# EAGLE board AM_BE200_x24_Rev2 (EAGLE 6.5.0), part 1 of 3
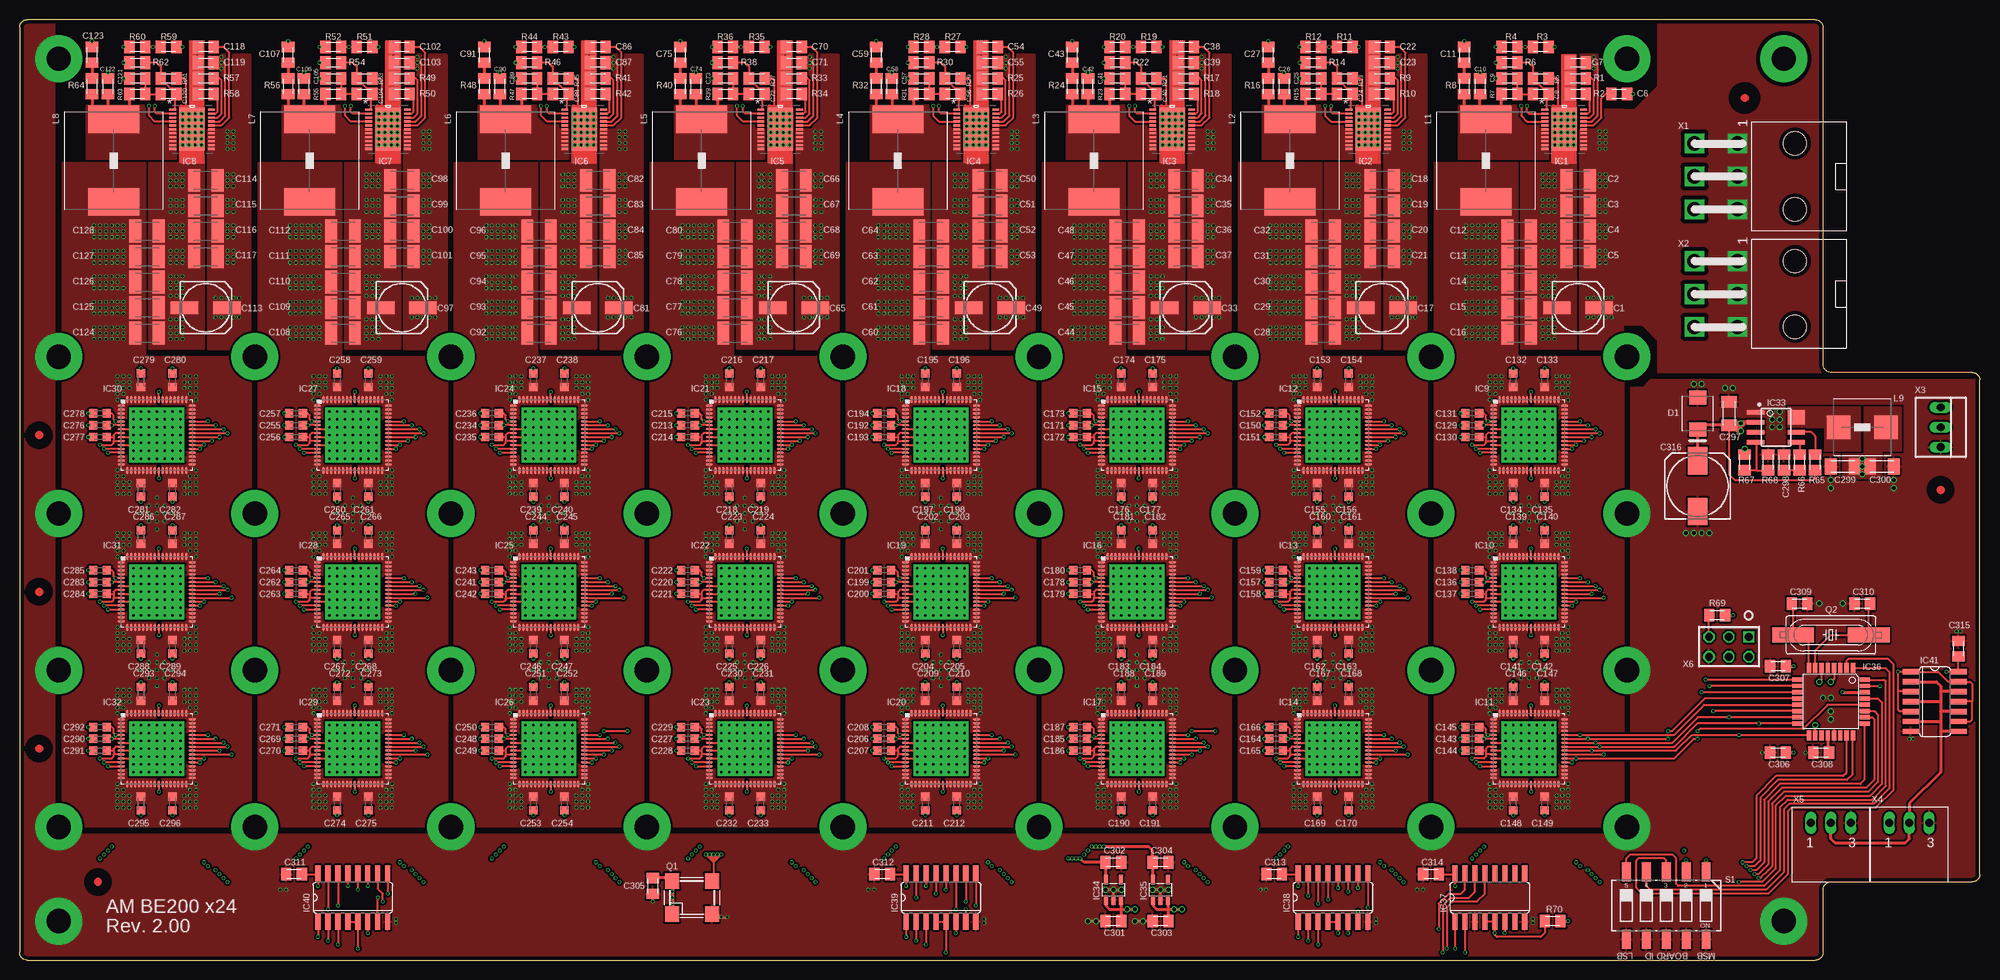
[diagram p9: board, top side]
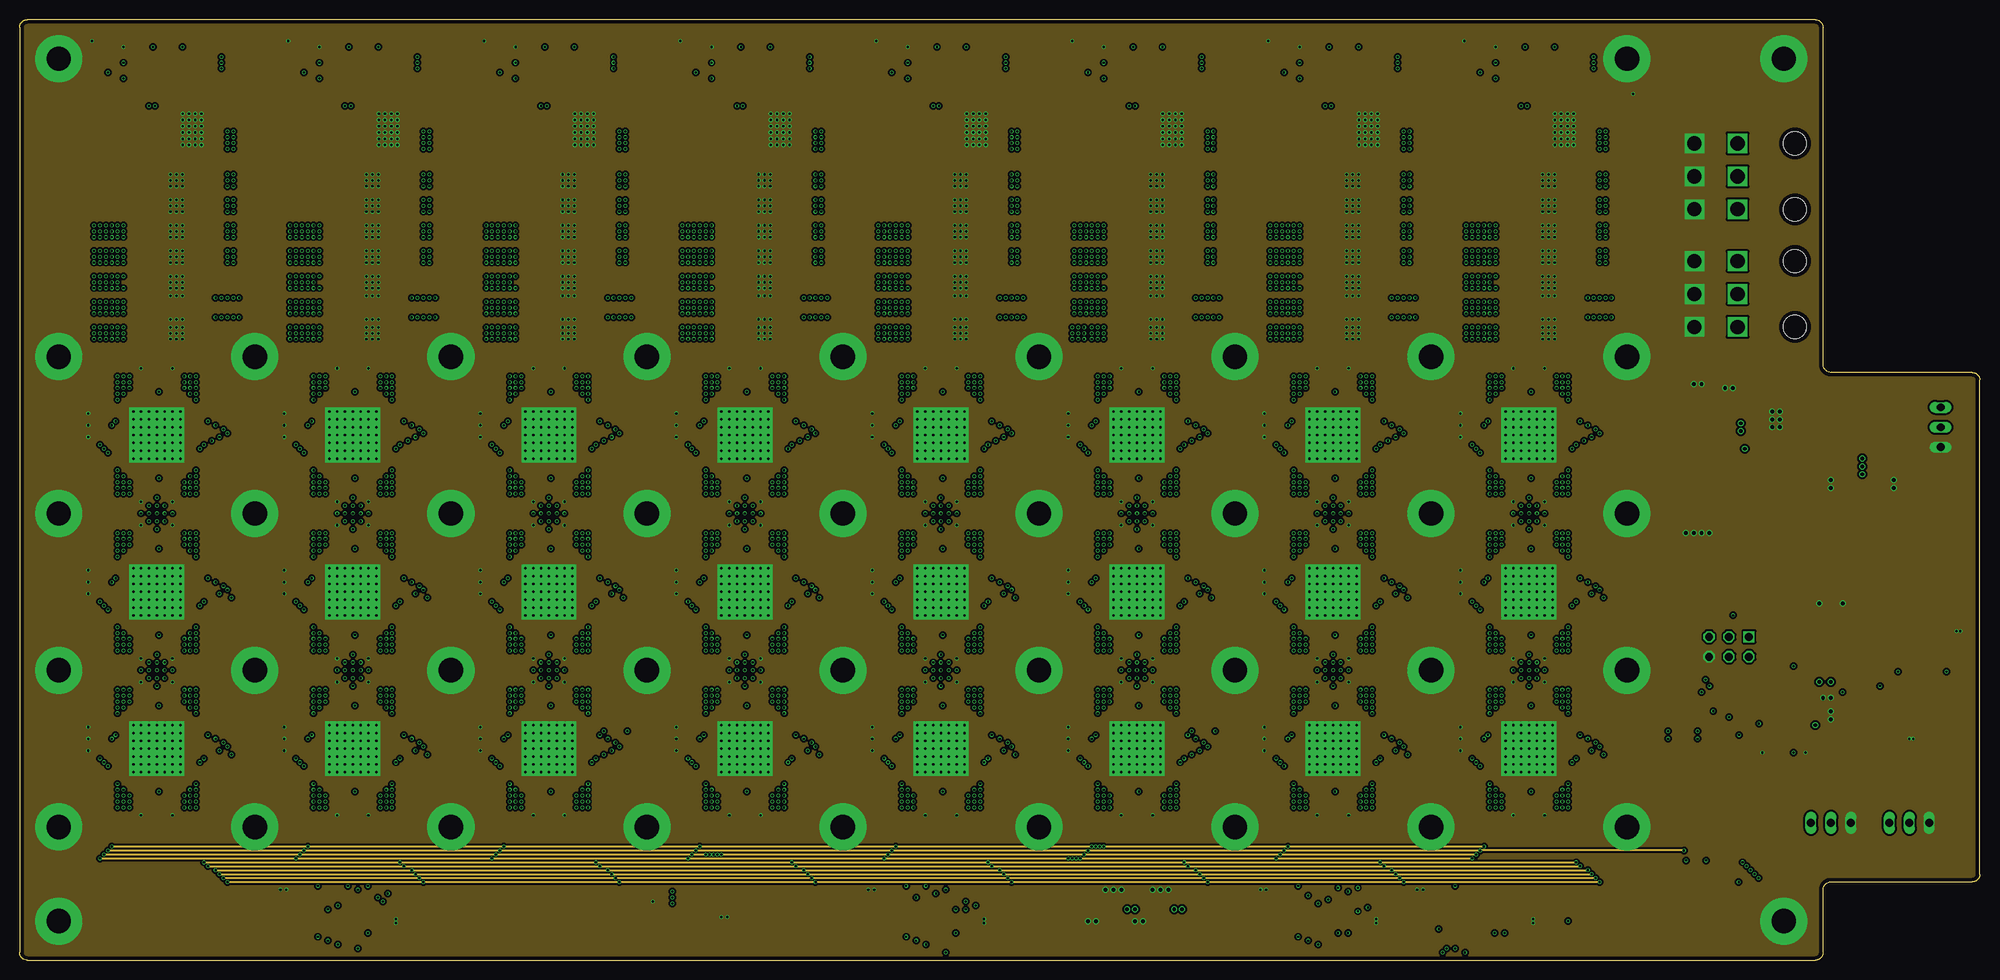
[diagram p10: board, inner layer Route2]
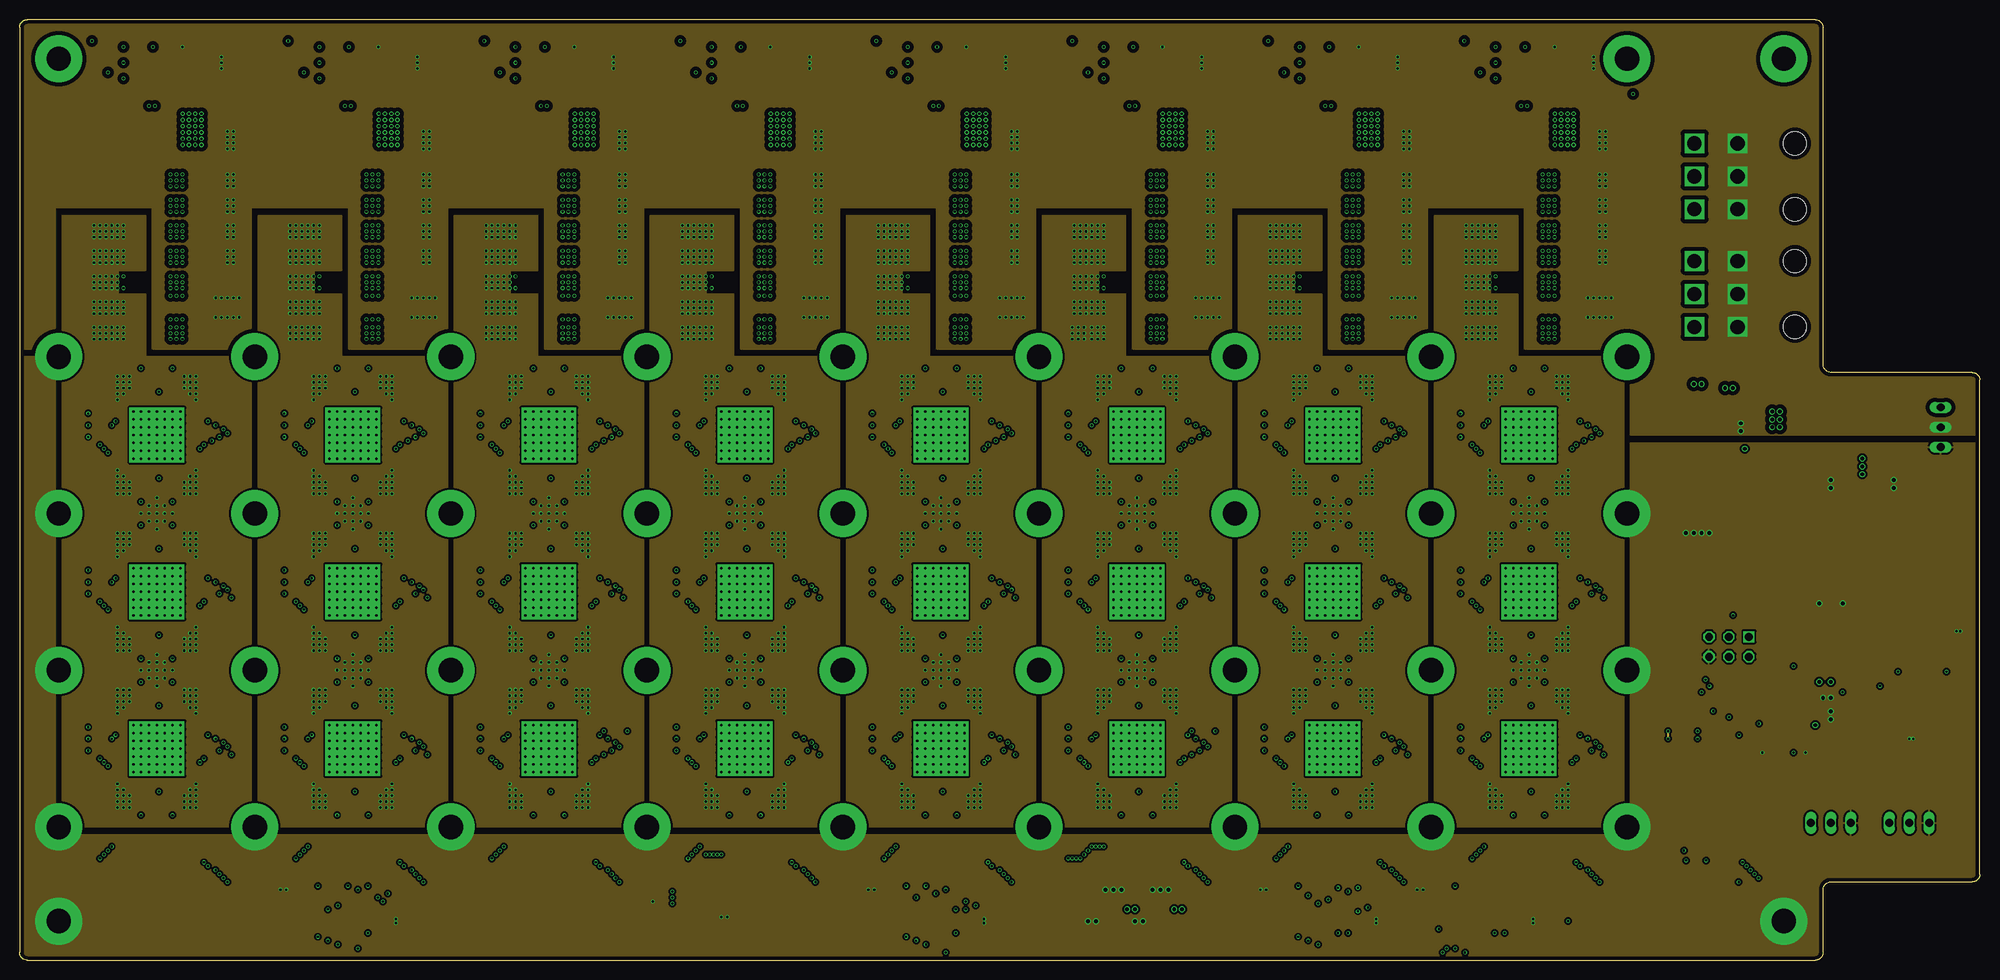
[diagram p11: board, inner layer Route3]
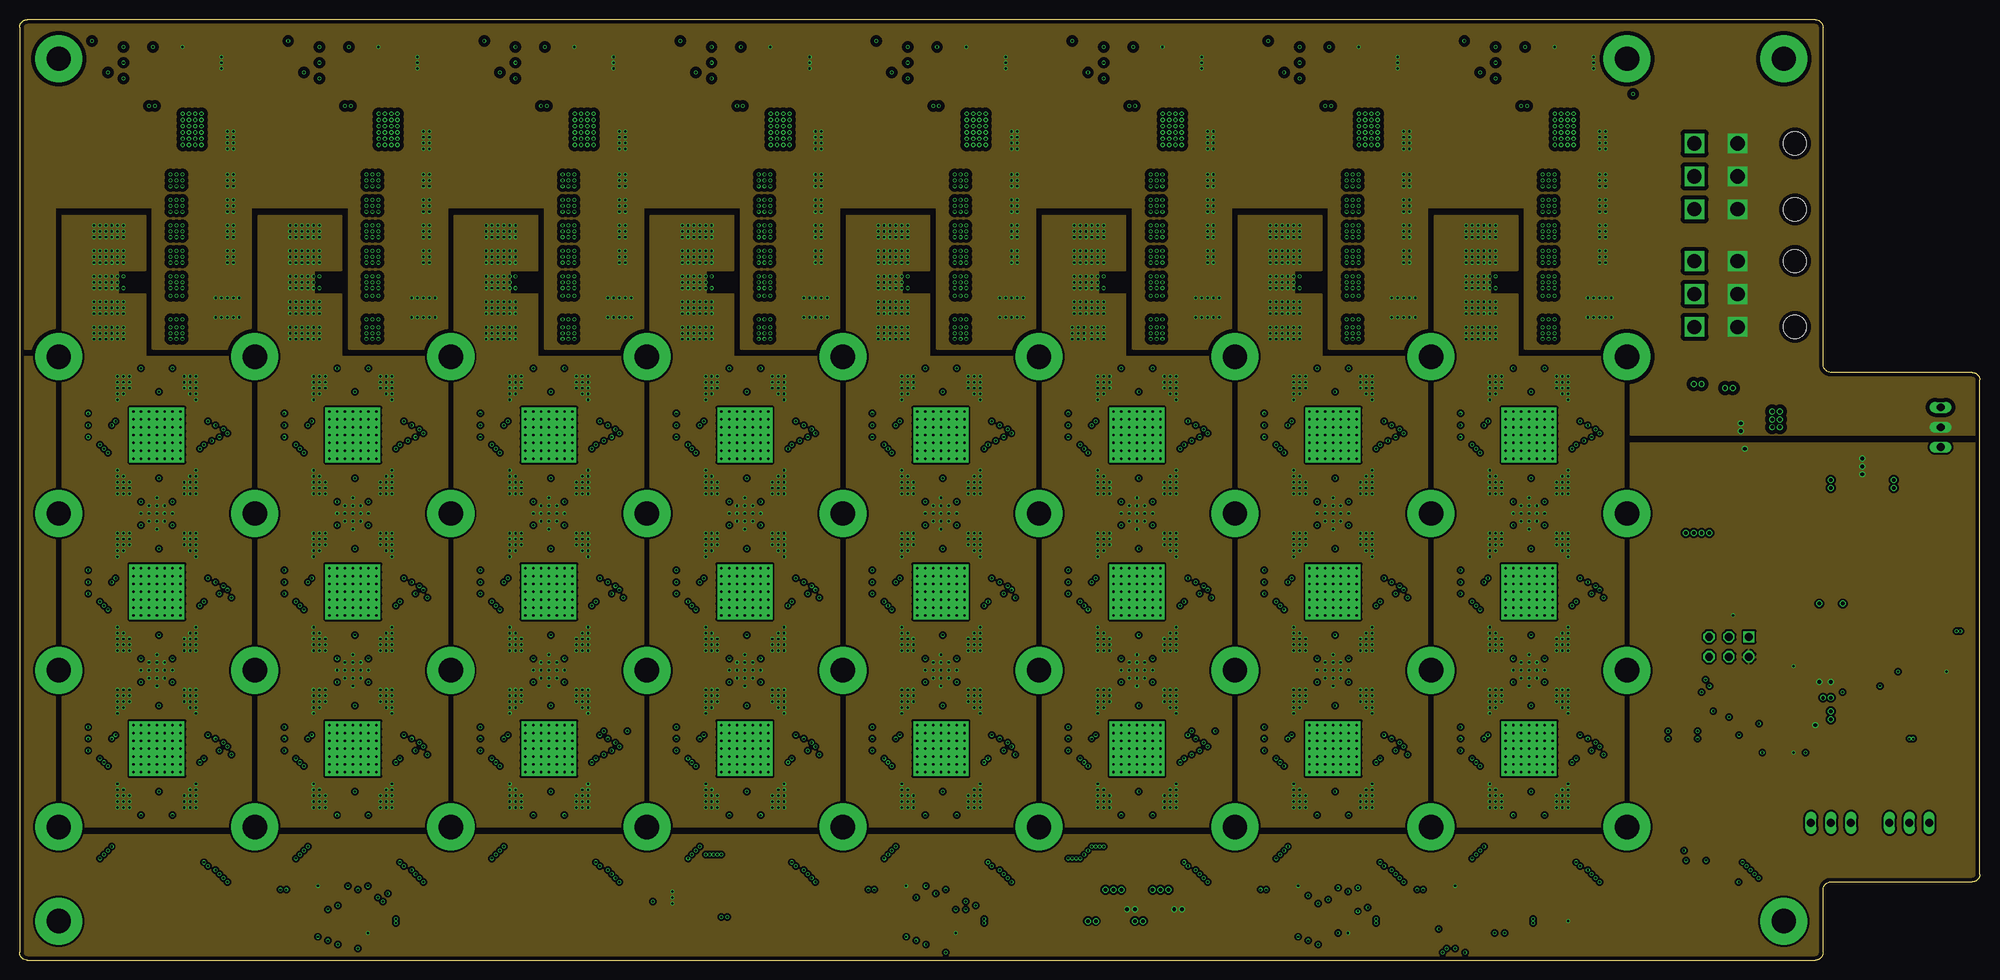
[diagram p12: board, inner layer Route14]
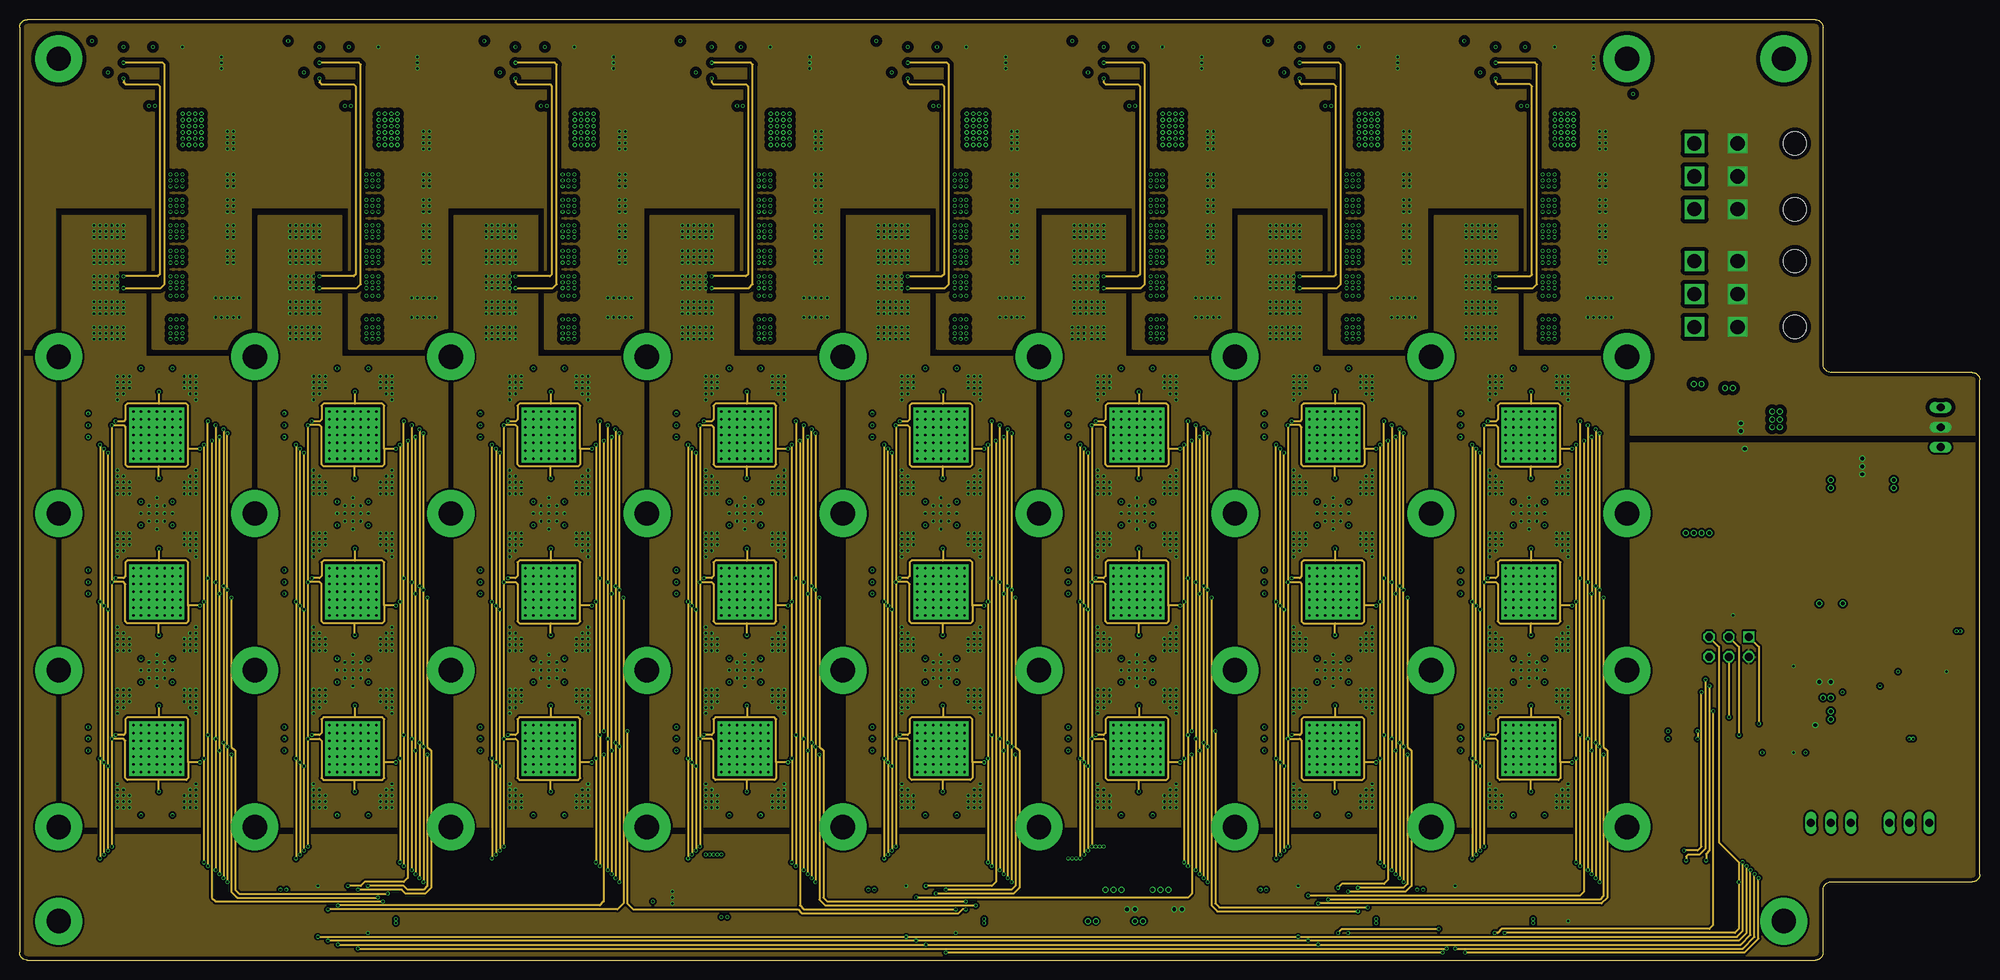
[diagram p13: board, inner layer Route15]
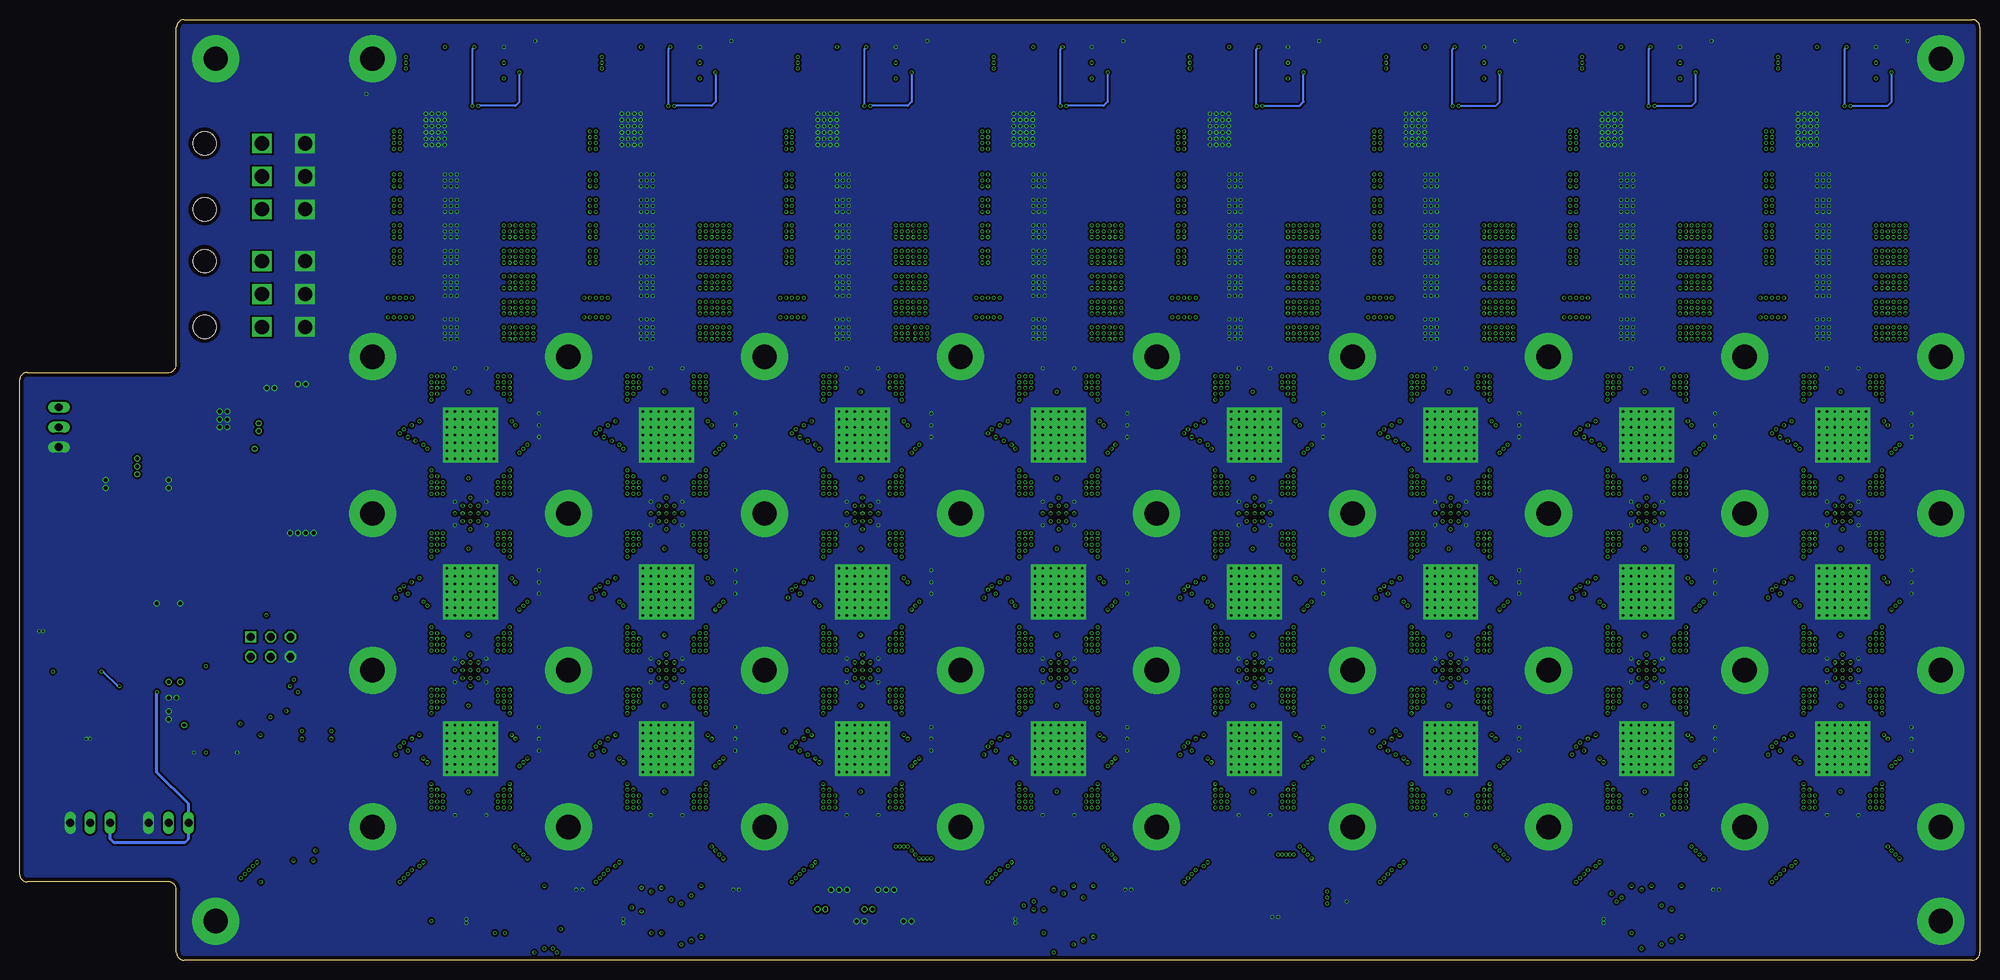
[diagram p14: board, bottom side, seen from below]

Size 250 x 120 mm. Coordinates in mm from the lower left corner, seen from the top.
Outline: 0,119 0,1 arc90 1,0 229,0 arc90 230,1 230,9 arc-90 231,10 249,10 arc90 250,11 250,74 arc90 249,75 231,75 arc-90 230,76 230,119 arc90 229,120 1,120 arc90 0,119
Copper layers (1*2*3*14*15*16): Top 0.035mm / dielectric 0.25mm / Route2 0.035mm / dielectric 0.25mm / Route3 0.035mm / dielectric 0.25mm / Route14 0.035mm / dielectric 0.25mm / Route15 0.035mm / dielectric 0.25mm / Bottom 0.035mm
Design rules "default *": minimum track width 8mil, minimum drill 0.3mm, track to track 5mil, track to pad 5mil, pad to pad 5mil, via to via 5mil, smd to smd 4mil, copper to edge 20mil, drill to drill 8mil, minimum pad ring 5mil, minimum via ring 0mil, stop-mask expansion 4mil, vias tented up to drill 30mil, thermal gap 10mil
tRestrict: area 218.2,61.2 to 221.2,68.2; area 20,109.2 to 23.8,117.5; area 45,109.2 to 48.8,117.5; area 70,109.2 to 73.8,117.5; area 95,109.2 to 98.8,117.5; area 120,109.2 to 123.8,117.5; area 145,109.2 to 148.8,117.5; area 170,109.2 to 173.8,117.5; area 195,109.2 to 198.8,117.5

## Footprints (pad centres in the part's own frame; a part is rotated, then mirrored left to right if it is on the bottom)
153CLV-0605 = smd 3.5 x 1.6: + 2.7,0; - -2.7,0
C1210K = smd 1.5 x 2.9: 1 -1.5,0; 2 1.5,0
C0805K = smd 1.3 x 1.6: 1 -1,0; 2 1,0
MYRCL_C0603K = smd 1.05 x 1.08: 1 -0.875,0; 2 0.875,0
C1206K = smd 1.5 x 2: 1 -1.5,0; 2 1.5,0
MYRCL_153CLV-0810 = smd 3.5 x 2.5: + 3.25,0; - -3.25,0
SMBJ = smd 1.78 x 2.16: A 2.04,0; C -2.03,0
DQP22_5P479X3P24 = smd 0.85 x 0.28: 1 -2.475,2.5; 2 -2.475,2; 3 -2.475,1.5; 4 -2.475,1; 5 -2.475,0.5; 6 -2.475,0; 7 -2.475,-0.5; 8 -2.475,-1; 9 -2.475,-1.5; 10 -2.475,-2; 11 -2.475,-2.5; 12 2.475,-2.5; 13 2.475,-2; 14 2.475,-1.5; 15 2.475,-1; 16 2.475,-0.5; 17 2.475,0; 18 2.475,0.5; 19 2.475,1; 20 2.475,1.5; 21 2.475,2; 22 2.475,2.5 | smd 3.24 x 5.48: 23 0,0 | drill 0.3: GND@1 -1.2,2; GND@2 -0.4,2; GND@3 0.4,2; GND@4 1.2,2; GND@5 -1.2,1.2; GND@6 -0.4,1.2; GND@7 0.4,1.2; GND@8 1.2,1.2; GND@9 -1.2,0.406; GND@10 -0.4,0.4; GND@11 0.4,0.4; GND@12 1.2,0.406; GND@13 -1.2,-0.406; GND@14 -0.4,-0.4; GND@15 0.4,-0.4; GND@16 1.2,-0.406; GND@17 -1.2,-1.2; GND@18 -0.4,-1.2; GND@19 0.4,-1.2; GND@20 1.2,-1.2; GND@21 -1.2,-2; GND@22 -0.4,-2; GND@23 0.4,-2; GND@24 1.2,-2
QFN64-9X9 = smd 0.95 x 0.28: 1 -4.525,3.75; 2 -4.525,3.25; 3 -4.525,2.75; 4 -4.525,2.25; 5 -4.525,1.75; 6 -4.525,1.25; 7 -4.525,0.75; 8 -4.525,0.25; 9 -4.525,-0.25; 10 -4.525,-0.75; 11 -4.525,-1.25; 12 -4.525,-1.75; 13 -4.525,-2.25; 14 -4.525,-2.75; 15 -4.525,-3.25; 16 -4.525,-3.75; 33 4.525,-3.75; 34 4.525,-3.25; 35 4.525,-2.75; 36 4.525,-2.25; 37 4.525,-1.75; 38 4.525,-1.25; 39 4.525,-0.75; 40 4.525,-0.25; 41 4.525,0.25; 42 4.525,0.75; 43 4.525,1.25; 44 4.525,1.75; 45 4.525,2.25; 46 4.525,2.75; 47 4.525,3.25; 48 4.525,3.75 | smd 0.28 x 0.95: 17 -3.75,-4.525; 18 -3.25,-4.525; 19 -2.75,-4.525; 20 -2.25,-4.525; 21 -1.75,-4.525; 22 -1.25,-4.525; 23 -0.75,-4.525; 24 -0.25,-4.525; 25 0.25,-4.525; 26 0.75,-4.525; 27 1.25,-4.525; 28 1.75,-4.525; 29 2.25,-4.525; 30 2.75,-4.525; 31 3.25,-4.525; 32 3.75,-4.525; 49 3.75,4.525; 50 3.25,4.525; 51 2.75,4.525; 52 2.25,4.525; 53 1.75,4.525; 54 1.25,4.525; 55 0.75,4.525; 56 0.25,4.525; 57 -0.25,4.525; 58 -0.75,4.525; 59 -1.25,4.525; 60 -1.75,4.525; 61 -2.25,4.525; 62 -2.75,4.525; 63 -3.25,4.525; 64 -3.75,4.525 | drill 0.3 pad 1 square: EXP@1 -3,3; EXP@2 -2,3; EXP@3 -1,3; EXP@4 0,3; EXP@5 1,3; EXP@6 2,3; EXP@7 3,3; EXP@8 -3,2; EXP@9 -2,2; EXP@10 -1,2; EXP@11 0,2; EXP@12 1,2; EXP@13 2,2; EXP@14 3,2; EXP@15 -3,1; EXP@16 -2,1; EXP@17 -1,1; EXP@18 0,1; EXP@19 1,1; EXP@20 2,1; EXP@21 3,1; EXP@22 -3,0; EXP@23 -2,0; EXP@24 -1,0; EXP@25 0,0; EXP@26 1,0; EXP@27 2,0; EXP@28 3,0; EXP@29 -3,-1; EXP@30 -2,-1; EXP@31 -1,-1; EXP@32 0,-1; EXP@33 1,-1; EXP@34 2,-1; EXP@35 3,-1; EXP@36 -3,-2; EXP@37 -2,-2; EXP@38 -1,-2; EXP@39 0,-2; EXP@40 1,-2; EXP@41 2,-2; EXP@42 3,-2; EXP@43 -3,-3; EXP@44 -2,-3; EXP@45 -1,-3; EXP@46 0,-3; EXP@47 1,-3; EXP@48 2,-3; EXP@49 3,-3
AOZ1021 = smd 0.6 x 2.2: AGND 0.635,-2.6; COMP 1.905,2.6; EN 0.635,2.6; FB 1.905,-2.6; PGND -1.905,-2.6; VIN -0.635,-2.6 | smd 1.87 x 2.2: LX -1.27,2.6
SOT-23-5 = smd 0.55 x 1.2: 1 -0.95,-1.3; 2 0,-1.3; 3 0.95,-1.3; 4 0.95,1.3; 5 -0.95,1.3
TQFP32-08 = smd 1.27 x 0.559: 1 -4.293,2.8; 2 -4.293,2; 3 -4.293,1.2; 4 -4.293,0.4; 5 -4.293,-0.4; 6 -4.293,-1.2; 7 -4.293,-2; 8 -4.293,-2.8; 17 4.293,-2.8; 18 4.293,-2; 19 4.293,-1.2; 20 4.293,-0.4; 21 4.293,0.4; 22 4.293,1.2; 23 4.293,2; 24 4.293,2.8 | smd 0.559 x 1.27: 9 -2.8,-4.293; 10 -2,-4.293; 11 -1.2,-4.293; 12 -0.4,-4.293; 13 0.4,-4.293; 14 1.2,-4.293; 15 2,-4.293; 16 2.8,-4.293; 25 2.8,4.293; 26 2,4.293; 27 1.2,4.293; 28 0.4,4.293; 29 -0.4,4.293; 30 -1.2,4.293; 31 -2,4.293; 32 -2.8,4.293
SO16 = smd 0.66 x 2.032: 1 -4.445,-3.073; 2 -3.175,-3.073; 3 -1.905,-3.073; 4 -0.635,-3.073; 5 0.635,-3.073; 6 1.905,-3.073; 7 3.175,-3.073; 8 4.445,-3.073; 9 4.445,3.073; 10 3.175,3.073; 11 1.905,3.073; 12 0.635,3.073; 13 -0.635,3.073; 14 -1.905,3.073; 15 -3.175,3.073; 16 -4.445,3.073
SO14 = smd 0.66 x 2.032: 1 -3.81,-3.073; 2 -2.54,-3.073; 3 -1.27,-3.073; 4 0,-3.073; 5 1.27,-3.073; 6 2.54,-3.073; 7 3.81,-3.073; 8 3.81,3.073; 9 2.54,3.073; 10 1.27,3.073; 11 0,3.073; 12 -1.27,3.073; 13 -2.54,3.073; 14 -3.81,3.073
INDUCTOR_PA0513 = smd 3.5 x 6.5: 1 -5.25,0; 2 5.25,0
INDCUCTOR_7.3X7.3 = smd 3 x 3: 1 -3,0; 2 3,0
OSCILLATOR_7X5_SMD = smd 1.8 x 2: 1 -2.54,-2.1; 2 2.54,-2.1; 3 2.54,2.1; 4 -2.54,2.1
HC49UP = smd 5.334 x 1.93: 1 -4.826,0; 2 4.826,0
R0805K = smd 1.3 x 1.6: 1 -1,0; 2 1,0
CTS-219-05 = smd 1.13 x 2.44: 1 -5.08,-4.3; 2 -2.54,-4.3; 3 0,-4.3; 4 2.54,-4.3; 5 5.08,-4.3; 6 5.08,4.3; 7 2.54,4.3; 8 0,4.3; 9 -2.54,4.3; 10 -5.08,4.3
PCIE6_4.2 = drill 1.8 square: P1 4.2,-2.1; P2 0,-2.1; P3 -4.2,-2.1; P4 4.2,3.4; P5 0,3.4; P6 -4.2,3.4 | hole 3: -4.2,-9.4; 4.2,-9.4
22-23-2031 = drill 1 long: 1 -2.54,0; 2 0,0; 3 2.54,0
XH2.54-3P = drill 1.016 long: 1 -2.54,2.54; 2 0,2.54; 3 2.54,2.54
AVR-ISP-6 = drill 1.016 square: 1 -2.54,-1.27 | drill 1.016 octagon: 2 -2.54,1.27; 3 0,-1.27; 4 0,1.27; 5 2.54,-1.27; 6 2.54,1.27

## Placement (x,y rotation side)
C1  100uF  [153CLV-0605]  198.75,83.25 0 top
C2  22uF  [C1210K]  198.75,99.5 180 top
C3  22uF  [C1210K]  198.75,96.25 180 top
C4  22uF  [C1210K]  198.75,93 180 top
C5  22uF  [C1210K]  198.75,89.75 180 top
C6  4.7uF  [C0805K]  204,110.5 0 top
C7  4.7uF  [C0805K]  198.75,114.5 180 top
C8  1nF  [C0805K]  194,110.5 0 top
C9  22nF  [C0805K]  190,112.5 0 top
C10  100nF  [C0805K]  186.25,111.5 270 top
C11  2,2nF  [C0805K]  184.25,115.5 90 top
C12  100uF  [C1210K]  191.25,93 0 top
C13  100uF  [C1210K]  191.25,89.75 0 top
C14  100uF  [C1210K]  191.25,86.5 0 top
C15  100uF  [C1210K]  191.25,83.25 0 top
C16  100uF  [C1210K]  191.25,80 0 top
C17  100uF  [153CLV-0605]  173.75,83.25 0 top
C18  22uF  [C1210K]  173.75,99.5 180 top
C19  22uF  [C1210K]  173.75,96.25 180 top
C20  22uF  [C1210K]  173.75,93 180 top
C21  22uF  [C1210K]  173.75,89.75 180 top
C22  4.7uF  [C0805K]  173.75,116.5 180 top
C23  4.7uF  [C0805K]  173.75,114.5 180 top
C24  1nF  [C0805K]  169,110.5 0 top
C25  22nF  [C0805K]  165,112.5 0 top
C26  100nF  [C0805K]  161.25,111.5 270 top
C27  2,2nF  [C0805K]  159.25,115.5 90 top
C28  100uF  [C1210K]  166.25,80 0 top
C29  100uF  [C1210K]  166.25,83.25 0 top
C30  100uF  [C1210K]  166.25,86.5 0 top
C31  100uF  [C1210K]  166.25,89.75 0 top
C32  100uF  [C1210K]  166.25,93 0 top
C33  100uF  [153CLV-0605]  148.75,83.25 0 top
C34  22uF  [C1210K]  148.75,99.5 180 top
C35  22uF  [C1210K]  148.75,96.25 180 top
C36  22uF  [C1210K]  148.75,93 180 top
C37  22uF  [C1210K]  148.75,89.75 180 top
C38  4.7uF  [C0805K]  148.75,116.5 180 top
C39  4.7uF  [C0805K]  148.75,114.5 180 top
C40  1nF  [C0805K]  144,110.5 0 top
C41  22nF  [C0805K]  140,112.5 0 top
C42  100nF  [C0805K]  136.25,111.5 270 top
C43  2,2nF  [C0805K]  134.25,115.5 90 top
C44  100uF  [C1210K]  141.25,80 0 top
C45  100uF  [C1210K]  141.25,83.25 0 top
C46  100uF  [C1210K]  141.25,86.5 0 top
C47  100uF  [C1210K]  141.25,89.75 0 top
C48  100uF  [C1210K]  141.25,93 0 top
C49  100uF  [153CLV-0605]  123.75,83.25 0 top
C50  22uF  [C1210K]  123.75,99.5 180 top
C51  22uF  [C1210K]  123.75,96.25 180 top
C52  22uF  [C1210K]  123.75,93 180 top
C53  22uF  [C1210K]  123.75,89.75 180 top
C54  4.7uF  [C0805K]  123.75,116.5 180 top
C55  4.7uF  [C0805K]  123.75,114.5 180 top
C56  1nF  [C0805K]  119,110.5 0 top
C57  22nF  [C0805K]  115,112.5 0 top
C58  100nF  [C0805K]  111.25,111.5 270 top
C59  2,2nF  [C0805K]  109.25,115.5 90 top
C60  100uF  [C1210K]  116.25,80 0 top
C61  100uF  [C1210K]  116.25,83.25 0 top
C62  100uF  [C1210K]  116.25,86.5 0 top
C63  100uF  [C1210K]  116.25,89.75 0 top
C64  100uF  [C1210K]  116.25,93 0 top
C65  100uF  [153CLV-0605]  98.75,83.25 0 top
C66  22uF  [C1210K]  98.75,99.5 180 top
C67  22uF  [C1210K]  98.75,96.25 180 top
C68  22uF  [C1210K]  98.75,93 180 top
C69  22uF  [C1210K]  98.75,89.75 180 top
C70  4.7uF  [C0805K]  98.75,116.5 180 top
C71  4.7uF  [C0805K]  98.75,114.5 180 top
C72  1nF  [C0805K]  94,110.5 0 top
C73  22nF  [C0805K]  90,112.5 0 top
C74  100nF  [C0805K]  86.25,111.5 270 top
C75  2,2nF  [C0805K]  84.25,115.5 90 top
C76  100uF  [C1210K]  91.25,80 0 top
C77  100uF  [C1210K]  91.25,83.25 0 top
C78  100uF  [C1210K]  91.25,86.5 0 top
C79  100uF  [C1210K]  91.25,89.75 0 top
C80  100uF  [C1210K]  91.25,93 0 top
C81  100uF  [153CLV-0605]  73.75,83.25 0 top
C82  22uF  [C1210K]  73.75,99.5 180 top
C83  22uF  [C1210K]  73.75,96.25 180 top
C84  22uF  [C1210K]  73.75,93 180 top
C85  22uF  [C1210K]  73.75,89.75 180 top
C86  4.7uF  [C0805K]  73.75,116.5 180 top
C87  4.7uF  [C0805K]  73.75,114.5 180 top
C88  1nF  [C0805K]  69,110.5 0 top
C89  22nF  [C0805K]  65,112.5 0 top
C90  100nF  [C0805K]  61.25,111.5 270 top
C91  2,2nF  [C0805K]  59.25,115.5 90 top
C92  100uF  [C1210K]  66.25,80 0 top
C93  100uF  [C1210K]  66.25,83.25 0 top
C94  100uF  [C1210K]  66.25,86.5 0 top
C95  100uF  [C1210K]  66.25,89.75 0 top
C96  100uF  [C1210K]  66.25,93 0 top
C97  100uF  [153CLV-0605]  48.75,83.25 0 top
C98  22uF  [C1210K]  48.75,99.5 180 top
C99  22uF  [C1210K]  48.75,96.25 180 top
C100  22uF  [C1210K]  48.75,93 180 top
C101  22uF  [C1210K]  48.75,89.75 180 top
C102  4.7uF  [C0805K]  48.75,116.5 180 top
C103  4.7uF  [C0805K]  48.75,114.5 180 top
C104  1nF  [C0805K]  44,110.5 0 top
C105  22nF  [C0805K]  40,112.5 0 top
C106  100nF  [C0805K]  36.25,111.5 270 top
C107  2,2nF  [C0805K]  34.25,115.5 90 top
C108  100uF  [C1210K]  41.25,80 0 top
C109  100uF  [C1210K]  41.25,83.25 0 top
C110  100uF  [C1210K]  41.25,86.5 0 top
C111  100uF  [C1210K]  41.25,89.75 0 top
C112  100uF  [C1210K]  41.25,93 0 top
C113  100uF  [153CLV-0605]  23.75,83.25 0 top
C114  22uF  [C1210K]  23.75,99.5 180 top
C115  22uF  [C1210K]  23.75,96.25 180 top
C116  22uF  [C1210K]  23.75,93 180 top
C117  22uF  [C1210K]  23.75,89.75 180 top
C118  4.7uF  [C0805K]  23.75,116.5 180 top
C119  4.7uF  [C0805K]  23.75,114.5 180 top
C120  1nF  [C0805K]  19,110.5 0 top
C121  22nF  [C0805K]  15,112.5 0 top
C122  100nF  [C0805K]  11.25,111.5 270 top
C123  2,2nF  [C0805K]  9.25,115.5 90 top
C124  100uF  [C1210K]  16.25,80 0 top
C125  100uF  [C1210K]  16.25,83.25 0 top
C126  100uF  [C1210K]  16.25,86.5 0 top
C127  100uF  [C1210K]  16.25,89.75 0 top
C128  100uF  [C1210K]  16.25,93 0 top
C129  100nF  [MYRCL_C0603K]  185.25,68.25 0 top
C130  100nF  [MYRCL_C0603K]  185.25,66.75 180 top
C131  100nF  [MYRCL_C0603K]  185.25,69.75 180 top
C132  100nF  [MYRCL_C0603K]  190.5,74 90 top
C133  4.7uF  [MYRCL_C0603K]  194.5,74 90 top
C134  100nF  [MYRCL_C0603K]  190.5,60 270 top
C135  4.7uF  [MYRCL_C0603K]  194.5,60 270 top
C136  100nF  [MYRCL_C0603K]  185.25,48.25 0 top
C137  100nF  [MYRCL_C0603K]  185.25,46.75 180 top
C138  100nF  [MYRCL_C0603K]  185.25,49.75 180 top
C139  100nF  [MYRCL_C0603K]  190.5,54 90 top
C140  4.7uF  [MYRCL_C0603K]  194.5,54 90 top
C141  100nF  [MYRCL_C0603K]  190.5,40 270 top
C142  4.7uF  [MYRCL_C0603K]  194.5,40 270 top
C143  100nF  [MYRCL_C0603K]  185.25,28.25 0 top
C144  100nF  [MYRCL_C0603K]  185.25,26.75 180 top
C145  100nF  [MYRCL_C0603K]  185.25,29.75 180 top
C146  100nF  [MYRCL_C0603K]  190.5,34 90 top
C147  4.7uF  [MYRCL_C0603K]  194.5,34 90 top
C148  100nF  [MYRCL_C0603K]  190.5,20 270 top
C149  4.7uF  [MYRCL_C0603K]  194.5,20 270 top
C150  100nF  [MYRCL_C0603K]  160.25,68.25 0 top
C151  100nF  [MYRCL_C0603K]  160.25,66.75 180 top
C152  100nF  [MYRCL_C0603K]  160.25,69.75 180 top
C153  100nF  [MYRCL_C0603K]  165.5,74 90 top
C154  4.7uF  [MYRCL_C0603K]  169.5,74 90 top
C155  100nF  [MYRCL_C0603K]  165.5,60 270 top
C156  4.7uF  [MYRCL_C0603K]  169.5,60 270 top
C157  100nF  [MYRCL_C0603K]  160.25,48.25 0 top
C158  100nF  [MYRCL_C0603K]  160.25,46.75 180 top
C159  100nF  [MYRCL_C0603K]  160.25,49.75 180 top
C160  100nF  [MYRCL_C0603K]  165.5,54 90 top
C161  4.7uF  [MYRCL_C0603K]  169.5,54 90 top
C162  100nF  [MYRCL_C0603K]  165.5,40 270 top
C163  4.7uF  [MYRCL_C0603K]  169.5,40 270 top
C164  100nF  [MYRCL_C0603K]  160.25,28.25 0 top
C165  100nF  [MYRCL_C0603K]  160.25,26.75 180 top
C166  100nF  [MYRCL_C0603K]  160.25,29.75 180 top
C167  100nF  [MYRCL_C0603K]  165.5,34 90 top
C168  4.7uF  [MYRCL_C0603K]  169.5,34 90 top
C169  100nF  [MYRCL_C0603K]  165.5,20 270 top
C170  4.7uF  [MYRCL_C0603K]  169.5,20 270 top
C171  100nF  [MYRCL_C0603K]  135.25,68.25 0 top
C172  100nF  [MYRCL_C0603K]  135.25,66.75 180 top
C173  100nF  [MYRCL_C0603K]  135.25,69.75 180 top
C174  100nF  [MYRCL_C0603K]  140.5,74 90 top
C175  4.7uF  [MYRCL_C0603K]  144.5,74 90 top
C176  100nF  [MYRCL_C0603K]  140.5,60 270 top
C177  4.7uF  [MYRCL_C0603K]  144.5,60 270 top
C178  100nF  [MYRCL_C0603K]  135.25,48.25 0 top
C179  100nF  [MYRCL_C0603K]  135.25,46.75 180 top
C180  100nF  [MYRCL_C0603K]  135.25,49.75 180 top
C181  100nF  [MYRCL_C0603K]  140.5,54 90 top
C182  4.7uF  [MYRCL_C0603K]  144.5,54 90 top
C183  100nF  [MYRCL_C0603K]  140.5,40 270 top
C184  4.7uF  [MYRCL_C0603K]  144.5,40 270 top
C185  100nF  [MYRCL_C0603K]  135.25,28.25 0 top
C186  100nF  [MYRCL_C0603K]  135.25,26.75 180 top
C187  100nF  [MYRCL_C0603K]  135.25,29.75 180 top
C188  100nF  [MYRCL_C0603K]  140.5,34 90 top
C189  4.7uF  [MYRCL_C0603K]  144.5,34 90 top
C190  100nF  [MYRCL_C0603K]  140.5,20 270 top
C191  4.7uF  [MYRCL_C0603K]  144.5,20 270 top
C192  100nF  [MYRCL_C0603K]  110.25,68.25 0 top
C193  100nF  [MYRCL_C0603K]  110.25,66.75 180 top
C194  100nF  [MYRCL_C0603K]  110.25,69.75 180 top
C195  100nF  [MYRCL_C0603K]  115.5,74 90 top
C196  4.7uF  [MYRCL_C0603K]  119.5,74 90 top
C197  100nF  [MYRCL_C0603K]  115.5,60 270 top
C198  4.7uF  [MYRCL_C0603K]  119.5,60 270 top
C199  100nF  [MYRCL_C0603K]  110.25,48.25 0 top
C200  100nF  [MYRCL_C0603K]  110.25,46.75 180 top
C201  100nF  [MYRCL_C0603K]  110.25,49.75 180 top
C202  100nF  [MYRCL_C0603K]  115.5,54 90 top
C203  4.7uF  [MYRCL_C0603K]  119.5,54 90 top
C204  100nF  [MYRCL_C0603K]  115.5,40 270 top
C205  4.7uF  [MYRCL_C0603K]  119.5,40 270 top
C206  100nF  [MYRCL_C0603K]  110.25,28.25 0 top
C207  100nF  [MYRCL_C0603K]  110.25,26.75 180 top
C208  100nF  [MYRCL_C0603K]  110.25,29.75 180 top
C209  100nF  [MYRCL_C0603K]  115.5,34 90 top
C210  4.7uF  [MYRCL_C0603K]  119.5,34 90 top
C211  100nF  [MYRCL_C0603K]  115.5,20 270 top
C212  4.7uF  [MYRCL_C0603K]  119.5,20 270 top
C213  100nF  [MYRCL_C0603K]  85.25,68.25 0 top
C214  100nF  [MYRCL_C0603K]  85.25,66.75 180 top
C215  100nF  [MYRCL_C0603K]  85.25,69.75 180 top
C216  100nF  [MYRCL_C0603K]  90.5,74 90 top
C217  4.7uF  [MYRCL_C0603K]  94.5,74 90 top
C218  100nF  [MYRCL_C0603K]  90.5,60 270 top
C219  4.7uF  [MYRCL_C0603K]  94.5,60 270 top
C220  100nF  [MYRCL_C0603K]  85.25,48.25 0 top
C221  100nF  [MYRCL_C0603K]  85.25,46.75 180 top
C222  100nF  [MYRCL_C0603K]  85.25,49.75 180 top
C223  100nF  [MYRCL_C0603K]  90.5,54 90 top
C224  4.7uF  [MYRCL_C0603K]  94.5,54 90 top
C225  100nF  [MYRCL_C0603K]  90.5,40 270 top
C226  4.7uF  [MYRCL_C0603K]  94.5,40 270 top
C227  100nF  [MYRCL_C0603K]  85.25,28.25 0 top
C228  100nF  [MYRCL_C0603K]  85.25,26.75 180 top
C229  100nF  [MYRCL_C0603K]  85.25,29.75 180 top
C230  100nF  [MYRCL_C0603K]  90.5,34 90 top
C231  4.7uF  [MYRCL_C0603K]  94.5,34 90 top
C232  100nF  [MYRCL_C0603K]  90.5,20 270 top
C233  4.7uF  [MYRCL_C0603K]  94.5,20 270 top
C234  100nF  [MYRCL_C0603K]  60.25,68.25 0 top
C235  100nF  [MYRCL_C0603K]  60.25,66.75 180 top
C236  100nF  [MYRCL_C0603K]  60.25,69.75 180 top
C237  100nF  [MYRCL_C0603K]  65.5,74 90 top
C238  4.7uF  [MYRCL_C0603K]  69.5,74 90 top
C239  100nF  [MYRCL_C0603K]  65.5,60 270 top
C240  4.7uF  [MYRCL_C0603K]  69.5,60 270 top
C241  100nF  [MYRCL_C0603K]  60.25,48.25 0 top
C242  100nF  [MYRCL_C0603K]  60.25,46.75 180 top
C243  100nF  [MYRCL_C0603K]  60.25,49.75 180 top
C244  100nF  [MYRCL_C0603K]  65.5,54 90 top
C245  4.7uF  [MYRCL_C0603K]  69.5,54 90 top
C246  100nF  [MYRCL_C0603K]  65.5,40 270 top
C247  4.7uF  [MYRCL_C0603K]  69.5,40 270 top
C248  100nF  [MYRCL_C0603K]  60.25,28.25 0 top
C249  100nF  [MYRCL_C0603K]  60.25,26.75 180 top
C250  100nF  [MYRCL_C0603K]  60.25,29.75 180 top
C251  100nF  [MYRCL_C0603K]  65.5,34 90 top
C252  4.7uF  [MYRCL_C0603K]  69.5,34 90 top
C253  100nF  [MYRCL_C0603K]  65.5,20 270 top
C254  4.7uF  [MYRCL_C0603K]  69.5,20 270 top
C255  100nF  [MYRCL_C0603K]  35.25,68.25 0 top
C256  100nF  [MYRCL_C0603K]  35.25,66.75 180 top
C257  100nF  [MYRCL_C0603K]  35.25,69.75 180 top
C258  100nF  [MYRCL_C0603K]  40.5,74 90 top
C259  4.7uF  [MYRCL_C0603K]  44.5,74 90 top
C260  100nF  [MYRCL_C0603K]  40.5,60 270 top
C261  4.7uF  [MYRCL_C0603K]  44.5,60 270 top
C262  100nF  [MYRCL_C0603K]  35.25,48.25 0 top
C263  100nF  [MYRCL_C0603K]  35.25,46.75 180 top
C264  100nF  [MYRCL_C0603K]  35.25,49.75 180 top
C265  100nF  [MYRCL_C0603K]  40.5,54 90 top
C266  4.7uF  [MYRCL_C0603K]  44.5,54 90 top
C267  100nF  [MYRCL_C0603K]  40.5,40 270 top
C268  4.7uF  [MYRCL_C0603K]  44.5,40 270 top
C269  100nF  [MYRCL_C0603K]  35.25,28.25 0 top
C270  100nF  [MYRCL_C0603K]  35.25,26.75 180 top
C271  100nF  [MYRCL_C0603K]  35.25,29.75 180 top
C272  100nF  [MYRCL_C0603K]  40.5,34 90 top
C273  4.7uF  [MYRCL_C0603K]  44.5,34 90 top
C274  100nF  [MYRCL_C0603K]  40.5,20 270 top
C275  4.7uF  [MYRCL_C0603K]  44.5,20 270 top
C276  100nF  [MYRCL_C0603K]  10.25,68.25 0 top
C277  100nF  [MYRCL_C0603K]  10.25,66.75 180 top
C278  100nF  [MYRCL_C0603K]  10.25,69.75 180 top
C279  100nF  [MYRCL_C0603K]  15.5,74 90 top
C280  4.7uF  [MYRCL_C0603K]  19.5,74 90 top
C281  100nF  [MYRCL_C0603K]  15.5,60 270 top
C282  4.7uF  [MYRCL_C0603K]  19.5,60 270 top
C283  100nF  [MYRCL_C0603K]  10.25,48.25 0 top
C284  100nF  [MYRCL_C0603K]  10.25,46.75 180 top
C285  100nF  [MYRCL_C0603K]  10.25,49.75 180 top
C286  100nF  [MYRCL_C0603K]  15.5,54 90 top
C287  4.7uF  [MYRCL_C0603K]  19.5,54 90 top
C288  100nF  [MYRCL_C0603K]  15.5,40 270 top
C289  4.7uF  [MYRCL_C0603K]  19.5,40 270 top
C290  100nF  [MYRCL_C0603K]  10.25,28.25 0 top
C291  100nF  [MYRCL_C0603K]  10.25,26.75 180 top
C292  100nF  [MYRCL_C0603K]  10.25,29.75 180 top
C293  100nF  [MYRCL_C0603K]  15.5,34 90 top
C294  4.7uF  [MYRCL_C0603K]  19.5,34 90 top
C295  100nF  [MYRCL_C0603K]  15.5,20 270 top
C296  4.7uF  [MYRCL_C0603K]  19.5,20 270 top
C297  10uF  [C1206K]  218,69.75 90 top
C298  2,2nF  [C0805K]  225,63.5 90 top
C299  22uF  [C1206K]  232.5,63 180 top
C300  22uF  [C1206K]  237.5,63 0 top
C301  4,7uF  [C0805K]  139.5,5 0 top
C302  4,7uF  [C0805K]  139.5,12.5 180 top
C303  4,7uF  [C0805K]  145.5,5 0 top
C304  4,7uF  [C0805K]  145.5,12.5 180 top
C305  100nF  [C0805K]  80.75,9.5 90 top
C306  100nF  [C0805K]  224.25,26.5 0 top
C307  4,7uF  [C0805K]  224.25,37.5 0 top
C308  100nF  [C0805K]  229.75,26.5 0 top
C309  22pF  [C0805K]  227,45.5 0 top
C310  22pF  [C0805K]  235,45.5 180 top
C311  100nF  [C0805K]  35,11 0 top
C312  100nF  [C0805K]  110,11 0 top
C313  100nF  [C0805K]  160,11 0 top
C314  100nF  [C0805K]  180,11 0 top
C315  100nF  [C0805K]  247.25,39.75 270 top
C316  220uF  [MYRCL_153CLV-0810]  214,60.5 90 top
D1  MBR_12V  [SMBJ]  214,69.75 90 top
IC1  TPS53353_TPS53355_DQP_22  [DQP22_5P479X3P24]  197,106 0 top
IC2  TPS53353_TPS53355_DQP_22  [DQP22_5P479X3P24]  172,106 0 top
IC3  TPS53353_TPS53355_DQP_22  [DQP22_5P479X3P24]  147,106 0 top
IC4  TPS53353_TPS53355_DQP_22  [DQP22_5P479X3P24]  122,106 0 top
IC5  TPS53353_TPS53355_DQP_22  [DQP22_5P479X3P24]  97,106 0 top
IC6  TPS53353_TPS53355_DQP_22  [DQP22_5P479X3P24]  72,106 0 top
IC7  TPS53353_TPS53355_DQP_22  [DQP22_5P479X3P24]  47,106 0 top
IC8  TPS53353_TPS53355_DQP_22  [DQP22_5P479X3P24]  22,106 0 top
IC9  BE200_QFN64_9X9  [QFN64-9X9]  192.5,67 0 top
IC10  BE200_QFN64_9X9  [QFN64-9X9]  192.5,47 0 top
IC11  BE200_QFN64_9X9  [QFN64-9X9]  192.5,27 0 top
IC12  BE200_QFN64_9X9  [QFN64-9X9]  167.5,67 0 top
IC13  BE200_QFN64_9X9  [QFN64-9X9]  167.5,47 0 top
IC14  BE200_QFN64_9X9  [QFN64-9X9]  167.5,27 0 top
IC15  BE200_QFN64_9X9  [QFN64-9X9]  142.5,67 0 top
IC16  BE200_QFN64_9X9  [QFN64-9X9]  142.5,47 0 top
IC17  BE200_QFN64_9X9  [QFN64-9X9]  142.5,27 0 top
IC18  BE200_QFN64_9X9  [QFN64-9X9]  117.5,67 0 top
IC19  BE200_QFN64_9X9  [QFN64-9X9]  117.5,47 0 top
IC20  BE200_QFN64_9X9  [QFN64-9X9]  117.5,27 0 top
IC21  BE200_QFN64_9X9  [QFN64-9X9]  92.5,67 0 top
IC22  BE200_QFN64_9X9  [QFN64-9X9]  92.5,47 0 top
IC23  BE200_QFN64_9X9  [QFN64-9X9]  92.5,27 0 top
IC24  BE200_QFN64_9X9  [QFN64-9X9]  67.5,67 0 top
IC25  BE200_QFN64_9X9  [QFN64-9X9]  67.5,47 0 top
IC26  BE200_QFN64_9X9  [QFN64-9X9]  67.5,27 0 top
IC27  BE200_QFN64_9X9  [QFN64-9X9]  42.5,67 0 top
IC28  BE200_QFN64_9X9  [QFN64-9X9]  42.5,47 0 top
IC29  BE200_QFN64_9X9  [QFN64-9X9]  42.5,27 0 top
IC30  BE200_QFN64_9X9  [QFN64-9X9]  17.5,67 0 top
IC31  BE200_QFN64_9X9  [QFN64-9X9]  17.5,47 0 top
IC32  BE200_QFN64_9X9  [QFN64-9X9]  17.5,27 0 top
IC33  AOZ1021  [AOZ1021]  224,68 270 top
IC34  TLV71209DBV  [SOT-23-5]  139.5,9 0 top
IC35  TLV7  [SOT-23-5]  145.5,9 0 top
IC36  MEGA88-AU  [TQFP32-08]  231,33 270 top
IC37  74HC138D  [SO16]  187.5,8 0 top
IC38  74HC138D  [SO16]  167.5,8 0 top
IC39  74HC138D  [SO16]  117.5,8 0 top
IC40  74HC138D  [SO16]  42.5,8 0 top
IC41  7407D  [SO14]  244.25,33 270 top
L1  0.47uH  [INDUCTOR_PA0513]  187,102 90 top
L2  0.47uH  [INDUCTOR_PA0513]  162,102 90 top
L3  0.47uH  [INDUCTOR_PA0513]  137,102 90 top
L4  0.47uH  [INDUCTOR_PA0513]  112,102 90 top
L5  0.47uH  [INDUCTOR_PA0513]  87,102 90 top
L6  0.47uH  [INDUCTOR_PA0513]  62,102 90 top
L7  0.47uH  [INDUCTOR_PA0513]  37,102 90 top
L8  0.47uH  [INDUCTOR_PA0513]  12,102 90 top
L9  4.7uH  [INDCUCTOR_7.3X7.3]  235,68 0 top
Q1  20MHZ  [OSCILLATOR_7X5_SMD]  85.75,8 0 top
Q2  7.37MHZ  [HC49UP]  231,41.5 0 top
R1  39K  [R0805K]  198.75,112.5 0 top
R2  180K  [R0805K]  198.75,110.5 0 top
R3  200K  [R0805K]  194,116.5 0 top
R4  100K  [R0805K]  190,116.5 0 top
R5  10K  [R0805K]  194,112.5 180 top
R6  2K49  [R0805K]  190,114.5 180 top
R7  56K  [R0805K]  190,110.5 180 top
R8  3 or 3.01  [R0805K]  184.25,111.5 270 top
R9  39K  [R0805K]  173.75,112.5 0 top
R10  180K  [R0805K]  173.75,110.5 0 top
R11  200K  [R0805K]  169,116.5 0 top
R12  100K  [R0805K]  165,116.5 0 top
R13  10K  [R0805K]  169,112.5 180 top
R14  2K49  [R0805K]  165,114.5 180 top
R15  56K  [R0805K]  165,110.5 180 top
R16  3 or 3.01  [R0805K]  159.25,111.5 270 top
R17  39K  [R0805K]  148.75,112.5 0 top
R18  180K  [R0805K]  148.75,110.5 0 top
R19  200K  [R0805K]  144,116.5 0 top
R20  100K  [R0805K]  140,116.5 0 top
R21  10K  [R0805K]  144,112.5 180 top
R22  2K49  [R0805K]  140,114.5 180 top
R23  56K  [R0805K]  140,110.5 180 top
R24  3 or 3.01  [R0805K]  134.25,111.5 270 top
R25  39K  [R0805K]  123.75,112.5 0 top
R26  180K  [R0805K]  123.75,110.5 0 top
R27  200K  [R0805K]  119,116.5 0 top
R28  100K  [R0805K]  115,116.5 0 top
R29  10K  [R0805K]  119,112.5 180 top
R30  2K49  [R0805K]  115,114.5 180 top
R31  56K  [R0805K]  115,110.5 180 top
R32  3 or 3.01  [R0805K]  109.25,111.5 270 top
R33  39K  [R0805K]  98.75,112.5 0 top
R34  180K  [R0805K]  98.75,110.5 0 top
R35  200K  [R0805K]  94,116.5 0 top
R36  100K  [R0805K]  90,116.5 0 top
R37  10K  [R0805K]  94,112.5 180 top
R38  2K49  [R0805K]  90,114.5 180 top
R39  56K  [R0805K]  90,110.5 180 top
R40  3 or 3.01  [R0805K]  84.25,111.5 270 top
R41  39K  [R0805K]  73.75,112.5 0 top
R42  180K  [R0805K]  73.75,110.5 0 top
R43  200K  [R0805K]  69,116.5 0 top
R44  100K  [R0805K]  65,116.5 0 top
R45  10K  [R0805K]  69,112.5 180 top
R46  2K49  [R0805K]  65,114.5 180 top
R47  56K  [R0805K]  65,110.5 180 top
R48  3 or 3.01  [R0805K]  59.25,111.5 270 top
R49  39K  [R0805K]  48.75,112.5 0 top
R50  180K  [R0805K]  48.75,110.5 0 top
R51  200K  [R0805K]  44,116.5 0 top
R52  100K  [R0805K]  40,116.5 0 top
R53  10K  [R0805K]  44,112.5 180 top
R54  2K49  [R0805K]  40,114.5 180 top
R55  56K  [R0805K]  40,110.5 180 top
R56  3 or 3.01  [R0805K]  34.25,111.5 270 top
R57  39K  [R0805K]  23.75,112.5 0 top
R58  180K  [R0805K]  23.75,110.5 0 top
R59  200K  [R0805K]  19,116.5 0 top
R60  100K  [R0805K]  15,116.5 0 top
R61  10K  [R0805K]  19,112.5 180 top
R62  2K49  [R0805K]  15,114.5 180 top
R63  56K  [R0805K]  15,110.5 180 top
R64  3 or 3.01  [R0805K]  9.25,111.5 270 top
R65  7K5  [R0805K]  229,63.5 270 top
R66  7K5  [R0805K]  227,63.5 90 top
R67  7K5  [R0805K]  220,63.5 90 top
R68  2K4  [R0805K]  223,63.5 270 top
R69  4K7  [R0805K]  216.5,44 0 top
R70  4K7  [R0805K]  195.5,5 0 top
S1  219-05  [CTS-219-05]  210,7 180 top
U$1  [MARKER-ROUND-1X3]  220,110 0 top
U$2  [MARKER-ROUND-1X3]  245,60 0 top
U$3  [MARKER-ROUND-1X3]  10,10 0 top
U$4  [MARKER-ROUND-1X3]  2.5,27 0 top
U$5  [MARKER-ROUND-1X3]  2.5,47 0 top
U$6  [MARKER-ROUND-1X3]  2.5,67 0 top
X1  MINI-FIT-JR-065.5MM  [PCIE6_4.2]  217,100 90 top
X2  MINI-FIT-JR-065.5MM  [PCIE6_4.2]  217,85 90 top
X3  22-23-2031  [22-23-2031]  245,68 270 top
X4  XH2.54-3P  [XH2.54-3P]  241,15 0 top
X5  XH2.54-3P  [XH2.54-3P]  231,15 0 top
X6  AVR-ISP-6VERT  [AVR-ISP-6]  218,40 180 top

## Tracks (layer width: path | path; a pad name or v marks a point on that pad's centre or on a via)
0.9V  (via drill 0.3)
  Top 0.254: IC29.8 37.25,27.25 37,27 37,26.75 | 37,26.75 37,26.25 | 37,26.25 IC29.10 | IC31.10 12,46.25 | IC31.8 12.25,47.25 12,47 12,46.75 | 12,46.75 12,46.25 | IC30.8 12.25,67.25 12,67 12,66.75 | 12,66.75 12,66.25 | 12,66.25 IC30.10 | IC32.10 12,26.25 | IC32.8 12.25,27.25 12,27 12,26.75 | 12,26.75 12,26.25 | IC25.8 62.25,47.25 62,47 62,46.75 | 62,46.75 62,46.25 | 62,46.25 IC25.10 | IC27.10 37,66.25 | IC27.8 37.25,67.25 37,67 37,66.75 | 37,66.75 37,66.25 | IC26.8 62.25,27.25 62,27 62,26.75 | 62,26.75 62,26.25 | 62,26.25 IC26.10 | IC28.10 37,46.25 | IC28.8 37.25,47.25 37,47 37,46.75 | 37,46.75 37,46.25 | IC21.8 87.25,67.25 87,67 87,66.75 | 87,66.75 87,66.25 | 87,66.25 IC21.10 | IC23.10 87,26.25 | IC23.8 87.25,27.25 87,27 87,26.75 | 87,26.75 87,26.25 | IC22.8 87.25,47.25 87,47 87,46.75 | 87,46.75 87,46.25 | 87,46.25 IC22.10 | IC24.10 62,66.25 | IC24.8 62.25,67.25 62,67 62,66.75 | 62,66.75 62,66.25 | IC17.8 137.25,27.25 137,27 137,26.75 | 137,26.75 137,26.25 | 137,26.25 IC17.10 | IC19.10 112,46.25 | IC19.8 112.25,47.25 112,47 112,46.75 | 112,46.75 112,46.25 | IC18.8 112.25,67.25 112,67 112,66.75 | 112,66.75 112,66.25 | 112,66.25 IC18.10 | IC20.10 112,26.25 | IC20.8 112.25,27.25 112,27 112,26.75 | 112,26.75 112,26.25 | IC13.8 162.25,47.25 162,47 162,46.75 | 162,46.75 162,46.25 | 162,46.25 IC13.10 | IC15.10 137,66.25 | IC15.8 137.25,67.25 137,67 137,66.75 | 137,66.75 137,66.25 | IC14.8 162.25,27.25 162,27 162,26.75 | 162,26.75 162,26.25 | 162,26.25 IC14.10 | IC16.10 137,46.25 | IC16.8 137.25,47.25 137,47 137,46.75 | 137,46.75 137,46.25 | IC9.8 187.25,67.25 187,67 187,66.75 | 187,66.75 187,66.25 | 187,66.25 IC9.10 | IC11.10 187,26.25 | 187,26.25 187,26 186.75,25.75 v185.25,25.75 | IC11.8 187.25,27.25 187,27 187,26.75
  Top 0.254: 187,26.75 187,26.25 | IC10.8 187.25,47.25 187,47 187,46.75 | 187,46.75 187,46.25 | 187,46.25 IC10.10 | IC12.10 162,66.25 | 162,66.25 162,66 161.75,65.75 v160.25,65.75 | IC12.8 162.25,67.25 162,67 162,66.75 | 162,66.75 162,66.25 | v185.25,45.75 186.75,45.75 187,46 187,46.25 | C137.1 187,46.75 | v185.25,65.75 186.75,65.75 187,66 187,66.25 | C130.1 187,66.75 | C144.1 187,26.75 | C151.1 162,66.75 | C165.1 162,26.75 | v160.25,25.75 161.75,25.75 162,26 162,26.25 | C158.1 162,46.75 | v160.25,45.75 161.75,45.75 162,46 162,46.25 | C179.1 137,46.75 | v135.25,45.75 136.75,45.75 137,46 137,46.25 | C172.1 137,66.75 | v135.25,65.75 136.75,65.75 137,66 137,66.25 | C207.1 112,26.75 | v110.25,25.75 111.75,25.75 112,26 112,26.25 | C200.1 112,46.75 | v110.25,45.75 111.75,45.75 112,46 112,46.25 | C193.1 112,66.75 | v110.25,65.75 111.75,65.75 112,66 112,66.25 | C186.1 137,26.75 | v135.25,25.75 136.75,25.75 137,26 137,26.25 | C235.1 62,66.75 | v60.25,65.75 61.75,65.75 62,66 62,66.25 | C228.1 87,26.75 | v85.25,25.75 86.75,25.75 87,26 87,26.25 | C221.1 87,46.75 | v85.25,45.75 86.75,45.75 87,46 87,46.25 | C214.1 87,66.75 | v85.25,65.75 86.75,65.75 87,66 87,66.25 | C242.1 62,46.75 | v60.25,45.75 61.75,45.75 62,46 62,46.25 | C249.1 62,26.75 | v60.25,25.75 61.75,25.75 62,26 62,26.25 | C263.1 37,46.75 | v35.25,45.75 36.75,45.75 37,46 37,46.25 | C256.1 37,66.75 | v35.25,65.75 36.75,65.75 37,66 37,66.25 | C291.1 12,26.75 | v10.25,25.75 11.75,25.75 12,26 12,26.25 | C284.1 12,46.75 | v10.25,45.75 11.75,45.75 12,46 12,46.25 | C277.1 12,66.75 | v10.25,65.75 11.75,65.75 12,66 12,66.25 | C270.1 37,26.75 | v35.25,25.75 36.75,25.75 37,26 37,26.25
  Top 0.406: IC34.5 138.55,12.45 C302.2 | 138.73,12.73 C302.2 | C302.2 135.75,12.5 v135.25,13 v134.75,13 v134.25,13 v133.75,13
  Route2 0.254: v10.25,13 v35.25,13 v60.25,13 v85.25,13 v110.25,13 v133.75,13 v134.25,13 v134.75,13 v135.25,13 v160.25,13 v185.25,13
  Route15 0.254: v10.25,65.75 v10.25,45.75 v10.25,25.75 v10.25,13 | v35.25,65.75 v35.25,45.75 v35.25,25.75 v35.25,13 | v60.25,65.75 v60.25,45.75 v60.25,25.75 v60.25,13 | v85.25,65.75 v85.25,45.75 v85.25,25.75 v85.25,13 | v110.25,65.75 v110.25,45.75 v110.25,25.75 v110.25,13 | v135.25,65.75 v135.25,45.75 v135.25,25.75 v135.25,13 v134.75,13 v134.25,13 v133.75,13 | v160.25,65.75 v160.25,45.75 v160.25,25.75 v160.25,13 | v185.25,65.75 v185.25,45.75 v185.25,25.75 v185.25,13
1.8V  (via drill 0.3)
  Top 0.254: IC29.6 v36.75,28.25 C269.2 | IC29.5 v37.25,28.75 37,29 37,29.5 36.75,29.75 C271.1 | IC29.56 v42.75,32.5 | IC29.25 v42.75,21.5 | IC29.37 v48,25.25 | IC31.37 v23,45.25 | IC31.25 v17.75,41.5 | IC31.56 v17.75,52.5 | IC31.5 v12.25,48.75 12,49 12,49.5 11.75,49.75 C285.1 | IC31.6 v11.75,48.25 C283.2 | IC30.6 v11.75,68.25 C276.2 | IC30.5 v12.25,68.75 12,69 12,69.5 11.75,69.75 C278.1 | IC30.56 v17.75,72.5 | IC30.25 v17.75,61.5 | IC30.37 v23,65.25 | IC32.37 v23,25.25 | IC32.25 v17.75,21.5 | IC32.56 v17.75,32.5 | IC32.5 v12.25,28.75 12,29 12,29.5 11.75,29.75 C292.1 | IC32.6 v11.75,28.25 C290.2 | IC25.6 v61.75,48.25 C241.2 | IC25.5 v62.25,48.75 62,49 62,49.5 61.75,49.75 C243.1 | IC25.56 v67.75,52.5 | IC25.25 v67.75,41.5 | IC25.37 v73,45.25 | IC27.37 v48,65.25 | IC27.25 v42.75,61.5 | IC27.56 v42.75,72.5 | IC27.5 v37.25,68.75 37,69 37,69.5 36.75,69.75 C257.1 | IC27.6 v36.75,68.25 C255.2 | IC26.6 v61.75,28.25 C248.2 | IC26.5 v62.25,28.75 62,29 62,29.5 61.75,29.75 C250.1 | IC26.56 v67.75,32.5 | IC26.25 v67.75,21.5 | IC26.37 v73,25.25 | IC28.37 v48,45.25 | IC28.25 v42.75,41.5 | IC28.56 v42.75,52.5 | IC28.5 v37.25,48.75 37,49 37,49.5 36.75,49.75 C264.1 | IC28.6 v36.75,48.25 C262.2 | IC21.6 v86.75,68.25 C213.2 | IC21.5 v87.25,68.75 87,69 87,69.5 86.75,69.75 C215.1 | IC21.56 v92.75,72.5 | IC21.25 v92.75,61.5 | IC21.37 v98,65.25 | IC23.37 v98,25.25 | IC23.25 v92.75,21.5 | IC23.56 v92.75,32.5 | IC23.5 v87.25,28.75 87,29 87,29.5 86.75,29.75 C229.1 | IC23.6 v86.75,28.25 C227.2 | IC22.6 v86.75,48.25 C220.2 | IC22.5 v87.25,48.75 87,49 87,49.5 86.75,49.75 C222.1 | IC22.56 v92.75,52.5 | IC22.25 v92.75,41.5 | IC22.37 v98,45.25 | IC24.37 v73,65.25 | IC24.25 v67.75,61.5 | IC24.56 v67.75,72.5
  Top 0.254: IC24.5 v62.25,68.75 62,69 62,69.5 61.75,69.75 C236.1 | IC24.6 v61.75,68.25 C234.2 | IC17.6 v136.75,28.25 C185.2 | IC17.5 v137.25,28.75 137,29 137,29.5 136.75,29.75 C187.1 | IC17.56 v142.75,32.5 | IC17.25 v142.75,21.5 | IC17.37 v148,25.25 | IC19.37 v123,45.25 | IC19.25 v117.75,41.5 | IC19.56 v117.75,52.5 | IC19.5 v112.25,48.75 112,49 112,49.5 111.75,49.75 C201.1 | IC19.6 v111.75,48.25 C199.2 | IC18.6 v111.75,68.25 C192.2 | IC18.5 v112.25,68.75 112,69 112,69.5 111.75,69.75 C194.1 | IC18.56 v117.75,72.5 | IC18.25 v117.75,61.5 | IC18.37 v123,65.25 | IC20.37 v123,25.25 | IC20.25 v117.75,21.5 | IC20.56 v117.75,32.5 | IC20.5 v112.25,28.75 112,29 112,29.5 111.75,29.75 C208.1 | IC20.6 v111.75,28.25 C206.2 | IC13.6 v161.75,48.25 C157.2 | IC13.5 v162.25,48.75 162,49 162,49.5 161.75,49.75 C159.1 | IC13.56 v167.75,52.5 | IC13.25 v167.75,41.5 | IC13.37 v173,45.25 | IC15.37 v148,65.25 | IC15.25 v142.75,61.5 | IC15.56 v142.75,72.5 | IC15.5 v137.25,68.75 137,69 137,69.5 136.75,69.75 C173.1 | IC15.6 v136.75,68.25 C171.2 | IC14.6 v161.75,28.25 C164.2 | IC14.5 v162.25,28.75 162,29 162,29.5 161.75,29.75 C166.1 | IC14.56 v167.75,32.5 | IC14.25 v167.75,21.5 | IC14.37 v173,25.25 | IC16.37 v148,45.25 | IC16.25 v142.75,41.5 | IC16.56 v142.75,52.5 | IC16.5 v137.25,48.75 137,49 137,49.5 136.75,49.75 C180.1 | IC16.6 v136.75,48.25 C178.2 | IC9.6 v186.75,68.25 C129.2 | IC9.5 v187.25,68.75 187,69 187,69.5 186.75,69.75 C131.1 | IC9.56 v192.75,72.5 | IC9.25 v192.75,61.5 | IC9.37 v198,65.25 | IC11.37 v198,25.25 | IC11.25 v192.75,21.5 | IC11.56 v192.75,32.5 | IC11.6 v186.75,28.25 C143.2 | IC10.6 v186.75,48.25 C136.2 | IC10.5 v187.25,48.75 187,49 187,49.5 186.75,49.75 C138.1
  Top 0.254: IC10.56 v192.75,52.5 | IC10.25 v192.75,41.5 | IC10.37 v198,45.25 | IC12.37 v173,65.25 | IC12.25 v167.75,61.5 | IC12.56 v167.75,72.5 | IC12.5 v162.25,68.75 162,69 162,69.5 161.75,69.75 C152.1 | IC12.6 v161.75,68.25 C150.2 | IC11.5 v187.25,28.75 187,29 187,29.5 186.75,29.75 C145.1
  Top 0.406: IC35.5 144.55,12.45 C304.2 | 144.73,12.73 C304.2 | v136.75,14.5 v137.25,14.5 v137.75,14.5 v138.25,14.5 144,14.5 144.5,14 C304.2
  Route2 0.254: v186.75,14.5 v161.75,14.5 v138.25,14.5 v137.75,14.5 v137.25,14.5 v136.75,14.5 v111.75,14.5 v86.75,14.5 v61.75,14.5 v36.75,14.5 v11.75,14.5
  Route15 0.254: v36.75,28.25 38.25,28.25 38.5,28 38.5,23.25 38.75,23 42.75,23 | 42.75,23 46.25,23 46.5,23.25 46.5,25.25 | 46.5,25.25 46.5,30.75 46.25,31 42.75,31 | 42.75,31 38.75,31 38.5,30.75 38.5,29 38.25,28.75 v37.25,28.75 | v42.75,32.5 42.75,31 | v42.75,21.5 42.75,23 | v48,25.25 46.5,25.25 | v23,45.25 21.5,45.25 | 21.5,45.25 21.5,43.25 21.25,43 17.75,43 | 17.75,43 13.75,43 13.5,43.25 13.5,48 13.25,48.25 v11.75,48.25 | v17.75,41.5 17.75,43 | 21.5,45.25 21.5,50.75 21.25,51 17.75,51 | 17.75,51 13.75,51 13.5,50.75 13.5,49 13.25,48.75 v12.25,48.75 | v17.75,52.5 17.75,51 | 17.75,63 13.75,63 13.5,63.25 13.5,68 13.25,68.25 v11.75,68.25 v11.75,48.25 | 17.75,63 21.25,63 21.5,63.25 21.5,65.25 | 21.5,65.25 21.5,70.75 21.25,71 17.75,71 | 17.75,71 13.75,71 13.5,70.75 13.5,69 13.25,68.75 v12.25,68.75 | v17.75,72.5 17.75,71 | v17.75,61.5 17.75,63 | v23,65.25 21.5,65.25 | v23,25.25 21.5,25.25 | 21.5,25.25 21.5,23.25 21.25,23 17.75,23 | 17.75,23 13.75,23 13.5,23.25 13.5,28 13.25,28.25 v11.75,28.25 | v17.75,21.5 17.75,23 | 21.5,25.25 21.5,30.75 21.25,31 17.75,31 | 17.75,31 13.75,31 13.5,30.75 13.5,29 13.25,28.75 v12.25,28.75 | v17.75,32.5 17.75,31 | v61.75,48.25 63.25,48.25 63.5,48 63.5,43.25 63.75,43 67.75,43 | 67.75,43 71.25,43 71.5,43.25 71.5,45.25 | 71.5,45.25 71.5,50.75 71.25,51 67.75,51 | 67.75,51 63.75,51 63.5,50.75 63.5,49 63.25,48.75 v62.25,48.75 | v67.75,52.5 67.75,51 | v67.75,41.5 67.75,43 | v73,45.25 71.5,45.25 | v48,65.25 46.5,65.25 | 46.5,65.25 46.5,63.25 46.25,63 42.75,63 | 42.75,63 38.75,63 38.5,63.25 38.5,68 38.25,68.25 v36.75,68.25 v36.75,48.25 | v42.75,61.5 42.75,63 | 46.5,65.25 46.5,70.75 46.25,71 42.75,71
  Route15 0.254: 42.75,71 38.75,71 38.5,70.75 38.5,69 38.25,68.75 v37.25,68.75 | v42.75,72.5 42.75,71 | v61.75,28.25 63.25,28.25 63.5,28 63.5,23.25 63.75,23 67.75,23 | 67.75,23 71.25,23 71.5,23.25 71.5,25.25 | 71.5,25.25 71.5,30.75 71.25,31 67.75,31 | 67.75,31 63.75,31 63.5,30.75 63.5,29 63.25,28.75 v62.25,28.75 | v67.75,32.5 67.75,31 | v67.75,21.5 67.75,23 | v73,25.25 71.5,25.25 | v48,45.25 46.5,45.25 | 46.5,45.25 46.5,43.25 46.25,43 42.75,43 | 42.75,43 38.75,43 38.5,43.25 38.5,48 38.25,48.25 v36.75,48.25 | v42.75,41.5 42.75,43 | 46.5,45.25 46.5,50.75 46.25,51 42.75,51 | 42.75,51 38.75,51 38.5,50.75 38.5,49 38.25,48.75 v37.25,48.75 | v42.75,52.5 42.75,51 | 92.75,63 88.75,63 88.5,63.25 88.5,68 88.25,68.25 v86.75,68.25 v86.75,48.25 | 92.75,63 96.25,63 96.5,63.25 96.5,65.25 | 96.5,65.25 96.5,70.75 96.25,71 92.75,71 | 92.75,71 88.75,71 88.5,70.75 88.5,69 88.25,68.75 v87.25,68.75 | v92.75,72.5 92.75,71 | v92.75,61.5 92.75,63 | v98,65.25 96.5,65.25 | v98,25.25 96.5,25.25 | 96.5,25.25 96.5,23.25 96.25,23 92.75,23 | 92.75,23 88.75,23 88.5,23.25 88.5,28 88.25,28.25 v86.75,28.25 | v92.75,21.5 92.75,23 | 96.5,25.25 96.5,30.75 96.25,31 92.75,31 | 92.75,31 88.75,31 88.5,30.75 88.5,29 88.25,28.75 v87.25,28.75 | v92.75,32.5 92.75,31 | v86.75,48.25 88.25,48.25 88.5,48 88.5,43.25 88.75,43 92.75,43 | 92.75,43 96.25,43 96.5,43.25 96.5,45.25 | 96.5,45.25 96.5,50.75 96.25,51 92.75,51 | 92.75,51 88.75,51 88.5,50.75 88.5,49 88.25,48.75 v87.25,48.75 | v92.75,52.5 92.75,51 | v92.75,41.5 92.75,43 | v98,45.25 96.5,45.25 | v73,65.25 71.5,65.25 | 71.5,65.25 71.5,63.25 71.25,63 67.75,63 | 67.75,63 63.75,63 63.5,63.25 63.5,68 63.25,68.25 v61.75,68.25 v61.75,48.25
  Route15 0.254: v67.75,61.5 67.75,63 | 71.5,65.25 71.5,70.75 71.25,71 67.75,71 | 67.75,71 63.75,71 63.5,70.75 63.5,69 63.25,68.75 v62.25,68.75 | v67.75,72.5 67.75,71 | v136.75,28.25 138.25,28.25 138.5,28 138.5,23.25 138.75,23 142.75,23 | 142.75,23 146.25,23 146.5,23.25 146.5,25.25 | 146.5,25.25 146.5,30.75 146.25,31 142.75,31 | 142.75,31 138.75,31 138.5,30.75 138.5,29 138.25,28.75 v137.25,28.75 | v142.75,32.5 142.75,31 | v142.75,21.5 142.75,23 | v148,25.25 146.5,25.25 | v123,45.25 121.5,45.25 | 121.5,45.25 121.5,43.25 121.25,43 117.75,43 | 117.75,43 113.75,43 113.5,43.25 113.5,48 113.25,48.25 v111.75,48.25 | v117.75,41.5 117.75,43 | 121.5,45.25 121.5,50.75 121.25,51 117.75,51 | 117.75,51 113.75,51 113.5,50.75 113.5,49 113.25,48.75 v112.25,48.75 | v117.75,52.5 117.75,51 | 117.75,63 113.75,63 113.5,63.25 113.5,68 113.25,68.25 v111.75,68.25 v111.75,48.25 | 117.75,63 121.25,63 121.5,63.25 121.5,65.25 | 121.5,65.25 121.5,70.75 121.25,71 117.75,71 | 117.75,71 113.75,71 113.5,70.75 113.5,69 113.25,68.75 v112.25,68.75 | v117.75,72.5 117.75,71 | v117.75,61.5 117.75,63 | v123,65.25 121.5,65.25 | v123,25.25 121.5,25.25 | 121.5,25.25 121.5,23.25 121.25,23 117.75,23 | 117.75,23 113.75,23 113.5,23.25 113.5,28 113.25,28.25 v111.75,28.25 | v117.75,21.5 117.75,23 | 121.5,25.25 121.5,30.75 121.25,31 117.75,31 | 117.75,31 113.75,31 113.5,30.75 113.5,29 113.25,28.75 v112.25,28.75 | v117.75,32.5 117.75,31 | v161.75,48.25 163.25,48.25 163.5,48 163.5,43.25 163.75,43 167.75,43 | 167.75,43 171.25,43 171.5,43.25 171.5,45.25 | 171.5,45.25 171.5,50.75 171.25,51 167.75,51 | 167.75,51 163.75,51 163.5,50.75 163.5,49 163.25,48.75 v162.25,48.75
  Route15 0.254: v167.75,52.5 167.75,51 | v167.75,41.5 167.75,43 | v173,45.25 171.5,45.25 | v148,65.25 146.5,65.25 | 146.5,65.25 146.5,63.25 146.25,63 142.75,63 | 142.75,63 138.75,63 138.5,63.25 138.5,68 138.25,68.25 v136.75,68.25 v136.75,48.25 | v142.75,61.5 142.75,63 | 146.5,65.25 146.5,70.75 146.25,71 142.75,71 | 142.75,71 138.75,71 138.5,70.75 138.5,69 138.25,68.75 v137.25,68.75 | v142.75,72.5 142.75,71 | v161.75,28.25 163.25,28.25 163.5,28 163.5,23.25 163.75,23 167.75,23 | 167.75,23 171.25,23 171.5,23.25 171.5,25.25 | 171.5,25.25 171.5,30.75 171.25,31 167.75,31 | 167.75,31 163.75,31 163.5,30.75 163.5,29 163.25,28.75 v162.25,28.75 | v167.75,32.5 167.75,31 | v167.75,21.5 167.75,23 | v173,25.25 171.5,25.25 | v148,45.25 146.5,45.25 | 146.5,45.25 146.5,43.25 146.25,43 142.75,43 | 142.75,43 138.75,43 138.5,43.25 138.5,48 138.25,48.25 v136.75,48.25 | v142.75,41.5 142.75,43 | 146.5,45.25 146.5,50.75 146.25,51 142.75,51 | 142.75,51 138.75,51 138.5,50.75 138.5,49 138.25,48.75 v137.25,48.75 | v142.75,52.5 142.75,51 | 192.75,63 188.75,63 188.5,63.25 188.5,68 188.25,68.25 v186.75,68.25 v186.75,48.25 | 192.75,63 196.25,63 196.5,63.25 196.5,65.25 | 196.5,65.25 196.5,70.75 196.25,71 192.75,71 | 192.75,71 188.75,71 188.5,70.75 188.5,69 188.25,68.75 v187.25,68.75 | v192.75,72.5 192.75,71 | v192.75,61.5 192.75,63 | v198,65.25 196.5,65.25 | v198,25.25 196.5,25.25 | 196.5,25.25 196.5,23.25 196.25,23 192.75,23 | 192.75,23 188.75,23 188.5,23.25 188.5,28 188.25,28.25 v186.75,28.25 | v192.75,21.5 192.75,23 | 196.5,25.25 196.5,30.75 196.25,31 192.75,31 | 192.75,31 188.75,31 188.5,30.75 188.5,29 188.25,28.75 v187.25,28.75
  Route15 0.254: v192.75,32.5 192.75,31 | v186.75,48.25 188.25,48.25 188.5,48 188.5,43.25 188.75,43 192.75,43 | 192.75,43 196.25,43 196.5,43.25 196.5,45.25 | 196.5,45.25 196.5,50.75 196.25,51 192.75,51 | 192.75,51 188.75,51 188.5,50.75 188.5,49 188.25,48.75 v187.25,48.75 | v192.75,52.5 192.75,51 | v192.75,41.5 192.75,43 | v198,45.25 196.5,45.25 | v173,65.25 171.5,65.25 | 171.5,65.25 171.5,63.25 171.25,63 167.75,63 | 167.75,63 163.75,63 163.5,63.25 163.5,68 163.25,68.25 v161.75,68.25 v161.75,48.25 | v167.75,61.5 167.75,63 | 171.5,65.25 171.5,70.75 171.25,71 167.75,71 | 167.75,71 163.75,71 163.5,70.75 163.5,69 163.25,68.75 v162.25,68.75 | v167.75,72.5 167.75,71 | v11.75,48.25 v11.75,28.25 | v11.75,28.25 v11.75,14.5 | v36.75,48.25 v36.75,28.25 | v36.75,28.25 v36.75,14.5 | v61.75,48.25 v61.75,28.25 | v61.75,28.25 v61.75,14.5 | v86.75,48.25 v86.75,28.25 | v86.75,28.25 v86.75,14.5 | v111.75,48.25 v111.75,28.25 | v111.75,28.25 v111.75,14.5 | v136.75,48.25 v136.75,28.25 | v136.75,28.25 v136.75,14.5 v137.25,14.5 v137.75,14.5 v138.25,14.5 | v161.75,48.25 v161.75,28.25 | v186.75,48.25 v186.75,28.25 | v186.75,28.25 v186.75,14.5 | v161.75,28.25 v161.75,14.5
+3V3  (via drill 0.3, 0.5)
  Top 0.254: R67.2 v220,65.25 | IC36.4 231.4,35.9 v231,35.5 | IC36.6 229.8,35.8 v229.5,35.5 | IC36.18 v229,30 | IC38.6 v169.41,3.5 | IC39.6 v119.41,3.5 | IC40.6 v44.41,3.5 | C311.2 38.05,11 | 38.05,11 IC40.16 | C312.2 113.06,11 | 113.06,11 IC39.16 | C313.2 163.06,11 | 163.06,11 IC38.16 | C314.2 183.06,11 | 183.06,11 IC37.16 | v245.75,36.81 IC41.14 247.25,36.81 C315.2 | 38.05,11 v38.05,9.5 | 113.06,11 v113.06,9.5 | 163.06,11 v163.06,9.5 | 183.06,11 v183.06,9.5 | R70.2 v197.5,5
  Top 0.406: 140.45,6.5 140.45,5.05 C301.2 | IC35.3 146.45,6.5 | 146.45,6.5 146.45,5.05 C303.2 | IC34.1 138.55,6.95 139,6.5 140.45,6.5 | IC35.1 144.55,6.95 145,6.5 146.45,6.5 | IC34.3 140.45,6.5 | 140.45,6.5 v141.25,6.5 v142.25,6.5 | 146.45,6.5 v147.25,6.5 v148.25,6.5 | C305.2 82.81,10.5 Q1.4 83.25,10.1 v83.25,8.75 v83.25,8 v83.25,7.25 83.25,5.9 Q1.1 | C306.2 v226.25,26.5 | R69.2 v218.5,44 | C307.2 v226.25,37.5
  other vias: 235,64 235,63 235,62
  pour Top (isolate 0.25, no thermals): 235.25,70.5 235.25,64.5 232.5,64.5 232.5,61.5 237.5,61.5 237.5,65 240,65 240,70.5
  pour Route15 (isolate 0.25, rank 2): 0,0 0,77 4.5,77 4.5,16 205.5,16 205.5,66 250,66 250,0
  pour Route14 (isolate 0.25, rank 2): 0,0 0,77 4.5,77 4.5,16 205.5,16 205.5,66 250,66 250,0
+12V  (via drill 0.3, 0.5)
  Top 0.254: C7.1 v200.75,114.5 201.25,114.5 201.25,107.75 200.5,107 IC1.19 | R3.2 v195.75,116.5 | R65.2 229,61.5 228.75,61.25 218.75,61.25 218,62 C297.1 | IC2.19 175.5,107 176.25,107.75 176.25,114.5 v175.75,114.5 | IC3.19 150.5,107 151.25,107.75 151.25,114.5 v150.75,114.5 | IC4.19 125.5,107 126.25,107.75 126.25,114.5 v125.75,114.5 | R11.2 v170.75,116.5 | R19.2 v145.75,116.5 | R27.2 v120.75,116.5 | R35.2 v95.75,116.5 | R43.2 v70.75,116.5 | R51.2 v45.75,116.5 | R59.2 v20.75,116.5 | IC5.19 100.5,107 101.25,107.75 101.25,114.5 v100.75,114.5 | IC6.19 75.5,107 76.25,107.75 76.25,114.5 v75.75,114.5 | IC7.19 50.5,107 51.25,107.75 51.25,114.5 v50.75,114.5 | IC8.19 25.5,107 26.25,107.75 26.25,114.5 v25.75,114.5
  Top 0.406: 218.25,68.5 C297.1 | IC33.VIN 219.5,68.64 | 219.5,68.64 v219.5,68.5 | C297.1 218.38,68.64 219.5,68.64 | 219,67.5 218.5,68 218.5,68.5 219,68.5 | v219.5,67.5 219.5,68 | 219.5,68 v219.5,68.5 | v219.5,68.5 219,68.5 | 219,68.5 219,68 | 219,68 219,67.5 | 219,67.5 v219.5,67.5 | v219.5,67.5 219,68 | 219,68 v219.5,68.5 | 220,68.5 219.5,68 | C297.1 214.53,68.25 D1.C C316.+
  other vias: 201.5,89.75 201.5,89 201.5,90.5 202.25,90.5 202.25,89.75 202.25,89 201.5,93 201.5,92.25 202.25,92.25 202.25,93 202.25,93.75 201.5,93.75 201.5,96.25 201.5,95.5 202.25,95.5 202.25,96.25 202.25,97 201.5,97 201.5,99.5 201.5,98.75 202.25,98.75 202.25,99.5 202.25,100.25 201.5,100.25 203,82 202.25,82 201.5,82 200.75,82 200,82 200,84.5 200.75,84.5 201.5,84.5 202.25,84.5 203,84.5 201.5,103.5 202.25,103.5 202.25,104.25 202.25,105 202.25,105.75 201.5,105.75 201.5,105 201.5,104.25 200.75,113.75 200.75,115.25 176.5,89.75 176.5,89 176.5,90.5 177.25,90.5 177.25,89.75 177.25,89 176.5,93 176.5,92.25 177.25,92.25 177.25,93 177.25,93.75 176.5,93.75 176.5,96.25 176.5,95.5 177.25,95.5 177.25,96.25 177.25,97 176.5,97 176.5,99.5 176.5,98.75 177.25,98.75 177.25,99.5 177.25,100.25 176.5,100.25 178,82 177.25,82 176.5,82 175.75,82 175,82 175,84.5 175.75,84.5 176.5,84.5 177.25,84.5 178,84.5 176.5,103.5 177.25,103.5 177.25,104.25 177.25,105 177.25,105.75 176.5,105.75 176.5,105 176.5,104.25 151.5,89.75 151.5,89 151.5,90.5 152.25,90.5 152.25,89.75 152.25,89 151.5,93 151.5,92.25 152.25,92.25 152.25,93 152.25,93.75 151.5,93.75 151.5,96.25 151.5,95.5 152.25,95.5 152.25,96.25 152.25,97 151.5,97 151.5,99.5 151.5,98.75 152.25,98.75 152.25,99.5 152.25,100.25 151.5,100.25 153,82 152.25,82 151.5,82 150.75,82 150,82 150,84.5 150.75,84.5 151.5,84.5 152.25,84.5 153,84.5 151.5,103.5 152.25,103.5 152.25,104.25 152.25,105 152.25,105.75 151.5,105.75 151.5,105 151.5,104.25 126.5,89.75 126.5,89 126.5,90.5 127.25,90.5 127.25,89.75 127.25,89 126.5,93 126.5,92.25 127.25,92.25 127.25,93 127.25,93.75 126.5,93.75 126.5,96.25 126.5,95.5 127.25,95.5 127.25,96.25 127.25,97 126.5,97 126.5,99.5 126.5,98.75 127.25,98.75 127.25,99.5 127.25,100.25 126.5,100.25 128,82 127.25,82 126.5,82 125.75,82 125,82 125,84.5 125.75,84.5 126.5,84.5 127.25,84.5 128,84.5 126.5,103.5 127.25,103.5 127.25,104.25 127.25,105 127.25,105.75 126.5,105.75 126.5,105 126.5,104.25 175.75,115.25 175.75,113.75 150.75,115.25 150.75,113.75 125.75,115.25 125.75,113.75 101.5,89.75 101.5,89 101.5,90.5 102.25,90.5 102.25,89.75 102.25,89 101.5,93 101.5,92.25 102.25,92.25 102.25,93 102.25,93.75 101.5,93.75 101.5,96.25 101.5,95.5 102.25,95.5 102.25,96.25 102.25,97 101.5,97 101.5,99.5 101.5,98.75 102.25,98.75 102.25,99.5 102.25,100.25 101.5,100.25 102.25,82 101.5,82 100.75,82 100,82 100,84.5 100.75,84.5 101.5,84.5 102.25,84.5 101.5,103.5 102.25,103.5 102.25,104.25 102.25,105 102.25,105.75 101.5,105.75 101.5,105 101.5,104.25 76.5,89.75 76.5,89 76.5,90.5 77.25,90.5 77.25,89.75 77.25,89 76.5,93 76.5,92.25 77.25,92.25 77.25,93 77.25,93.75 76.5,93.75 76.5,96.25 76.5,95.5 77.25,95.5 77.25,96.25 77.25,97 76.5,97 76.5,99.5 76.5,98.75 77.25,98.75 77.25,99.5 77.25,100.25 76.5,100.25 78,82 77.25,82 76.5,82 75.75,82 75,82 75,84.5 75.75,84.5 76.5,84.5 77.25,84.5 78,84.5 76.5,103.5 77.25,103.5 77.25,104.25 77.25,105 77.25,105.75 76.5,105.75 76.5,105 76.5,104.25 51.5,89.75 51.5,89 51.5,90.5 52.25,90.5 52.25,89.75 52.25,89 51.5,93 51.5,92.25 52.25,92.25 52.25,93 52.25,93.75 51.5,93.75 51.5,96.25 51.5,95.5 52.25,95.5 52.25,96.25 52.25,97 51.5,97 51.5,99.5 51.5,98.75 52.25,98.75 52.25,99.5 52.25,100.25 51.5,100.25 53,82 52.25,82 51.5,82 50.75,82 50,82 50,84.5 50.75,84.5 51.5,84.5 52.25,84.5 53,84.5 51.5,103.5 52.25,103.5 52.25,104.25 52.25,105 52.25,105.75 51.5,105.75 51.5,105 51.5,104.25 26.5,89.75 26.5,89 26.5,90.5 27.25,90.5 27.25,89.75 27.25,89 26.5,93 26.5,92.25 27.25,92.25 27.25,93 27.25,93.75 26.5,93.75 26.5,96.25 26.5,95.5 27.25,95.5 27.25,96.25 27.25,97 26.5,97 26.5,99.5 26.5,98.75 27.25,98.75 27.25,99.5 27.25,100.25 26.5,100.25 28,82 27.25,82 26.5,82 25.75,82 25,82 25,84.5 25.75,84.5 26.5,84.5 27.25,84.5 28,84.5 26.5,103.5 27.25,103.5 27.25,104.25 27.25,105 27.25,105.75 26.5,105.75 26.5,105 26.5,104.25 100.75,115.25 100.75,113.75 75.75,115.25 75.75,113.75 50.75,115.25 50.75,113.75 25.75,115.25 25.75,113.75 103,84.5 103,82
  pour Top (isolate 0.5, rank 2, no thermals): 250,120 250,75 209,75 209,79 207,81 204.5,81 204.5,108.5 206,108.5 209,111.5 209,120
  pour Route3 (isolate 0.5, rank 2, no thermals): 0,120 250,120 250,67 205.5,67 205.5,78 192,78 192,96 179.5,96 179.5,78 167,78 167,96 154.5,96 154.5,78 142,78 142,96 129.5,96 129.5,78 117,78 117,96 104.5,96 104.5,78 92,78 92,96 79.5,96 79.5,78 67,78 67,96 54.5,96 54.5,78 42,78 42,96 29.5,96 29.5,78 17,78 17,96 4.5,96 4.5,78 0,78
  pour Route14 (isolate 0.5, rank 2, no thermals): 0,120 250,120 250,67 205.5,67 205.5,78 192,78 192,96 179.5,96 179.5,78 167,78 167,96 154.5,96 154.5,78 142,78 142,96 129.5,96 129.5,78 117,78 117,96 104.5,96 104.5,78 92,78 92,96 79.5,96 79.5,78 67,78 67,96 54.5,96 54.5,78 42,78 42,96 29.5,96 29.5,78 17,78 17,96 4.5,96 4.5,78 0,78
  pour Route15 (isolate 0.5, rank 2, no thermals): 0,120 250,120 250,67 205.5,67 205.5,78 192,78 192,96 179.5,96 179.5,78 167,78 167,96 154.5,96 154.5,78 142,78 142,96 129.5,96 129.5,78 117,78 117,96 104.5,96 104.5,78 92,78 92,96 79.5,96 79.5,78 67,78 67,96 54.5,96 54.5,78 42,78 42,96 29.5,96 29.5,78 17,78 17,96 4.5,96 4.5,78 0,78
  pour Top (isolate 0.25, rank 2, no thermals): 29.5,78 29.5,115.5 24,115.5 24,78
  pour Top (isolate 0.25, rank 2, no thermals): 54.5,78 54.5,115.5 49,115.5 49,78
  pour Top (isolate 0.25, rank 2, no thermals): 79.5,78 79.5,115.5 74,115.5 74,78